# Altium project Somiqboard.PrjPcb
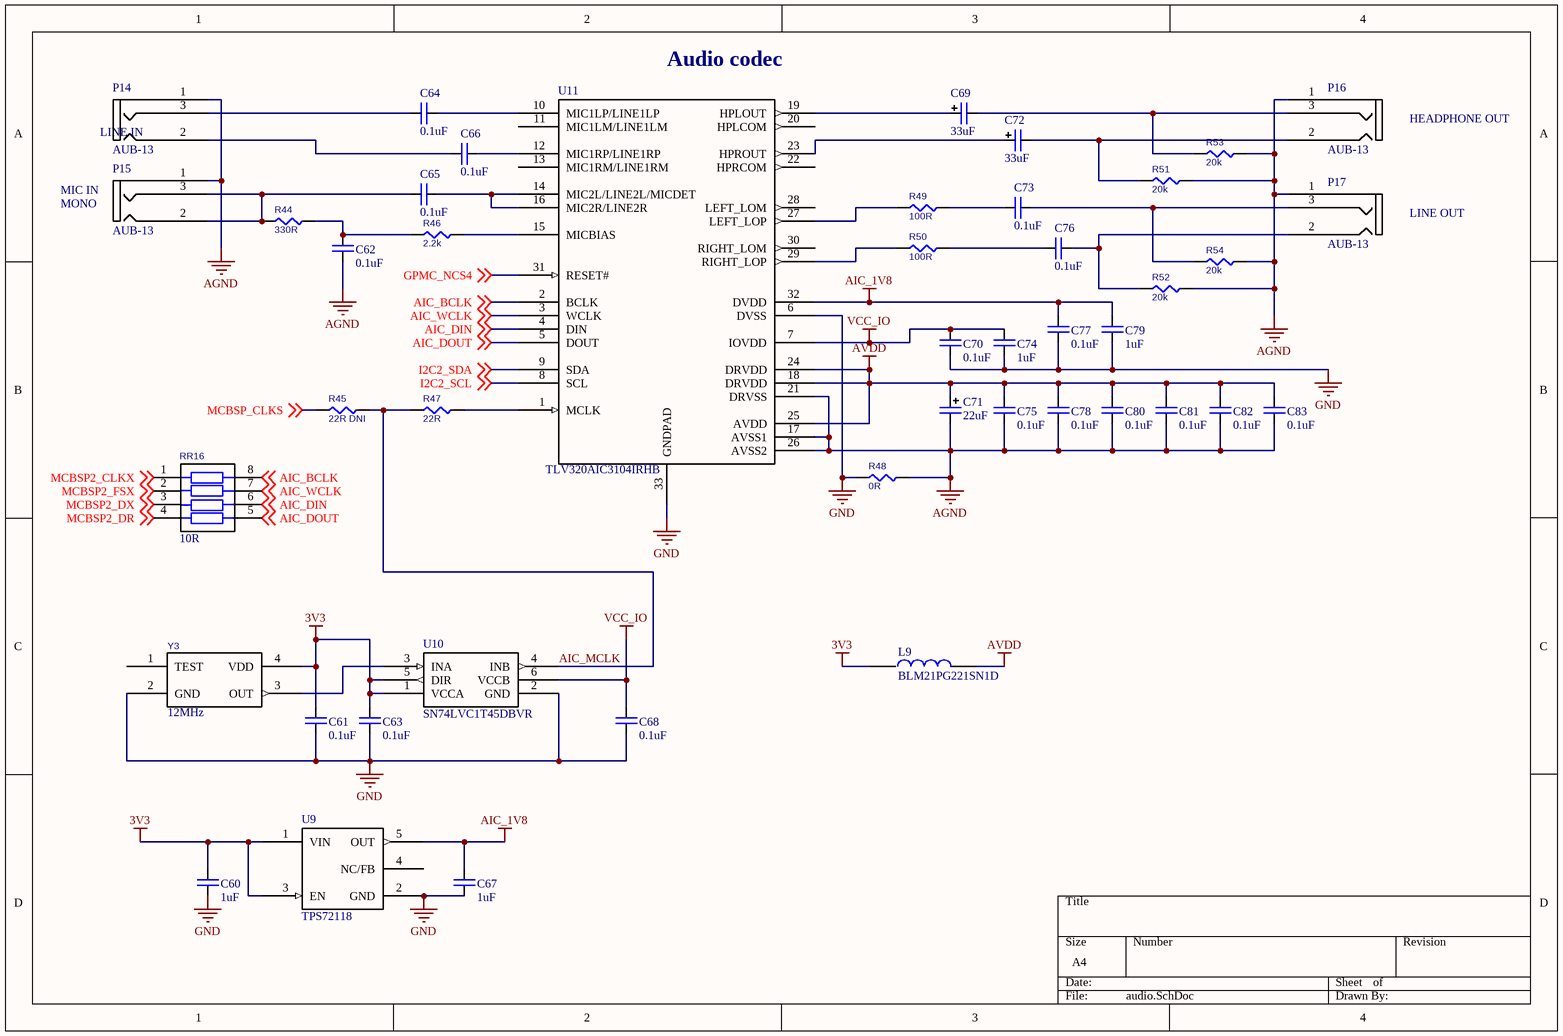
[diagram p0: audio.SchDoc]
9 sheets, 206 parts. Net scope: global (net labels, ports and power ports of the same name join across sheets).
Board file: somiqboard.PcbDoc
Sheets:
  audio.SchDoc
  camera.SchDoc
  ethernet.SchDoc
  hdmi.SchDoc
  power.SchDoc
  sd_mmc.SchDoc
  serial.SchDoc
  som_connectors.SchDoc
  usb.SchDoc

## Sheet audio.SchDoc
size A4

### Parts
(Parts that share a designator on the sheet are numbered #1, #2 ... from top to bottom, then left to right.)
C60  value 1uF  [CHIP0603]  (hidden comment: C0603)
C61  value 0.1uF  [CHIP0603]  (hidden comment: C0603)
C62  value 0.1uF  [CHIP0603]  (hidden comment: C0603)
C63  value 0.1uF  [CHIP0603]  (hidden comment: C0603)
C64  value 0.1uF  [CHIP0603]  (hidden comment: C0603)
C65  value 0.1uF  [CHIP0603]  (hidden comment: C0603)
C66  value 0.1uF  [CHIP0603]  (hidden comment: C0603)
C67  value 1uF  [CHIP0603]  (hidden comment: C0603)
C68  value 0.1uF  [CHIP0603]  (hidden comment: C0603)
C69  value 33uF  [B]  (hidden comment: CAP B)
C70  value 0.1uF  [CHIP0603]  (hidden comment: C0603)
C71  value 22uF  [B]  (hidden comment: CAP B)
C72  value 33uF  [B]  (hidden comment: CAP B)
C73#1  value 0.1uF  [CHIP0603]  (hidden comment: C0603)
C74#1  value 1uF  [CHIP0603]  (hidden comment: C0603)
C75  value 0.1uF  [CHIP0603]  (hidden comment: C0603)
C76  value 0.1uF  [CHIP0603]  (hidden comment: C0603)
C77  value 0.1uF  [CHIP0603]  (hidden comment: C0603)
C78  value 0.1uF  [CHIP0603]  (hidden comment: C0603)
C79  value 1uF  [CHIP0603]  (hidden comment: C0603)
C80  value 0.1uF  [CHIP0603]  (hidden comment: C0603)
C81  value 0.1uF  [CHIP0603]  (hidden comment: C0603)
C82  value 0.1uF  [CHIP0603]  (hidden comment: C0603)
C83  value 0.1uF  [CHIP0603]  (hidden comment: C0603)
L9  BLM21PG221SN1D  [Chip2PinSM127P600-8N]
P14  AUB-13  [AUB_13]
P15  AUB-13  [AUB_13]
P16  AUB-13  [AUB_13]
P17  AUB-13  [AUB_13]
R44  value 330R  [CHIP0603]  (hidden comment: R0603)
R45  value 22R DNI  [CHIP0603]  (hidden comment: R0603)
R46  value 2.2k  [CHIP0603]  (hidden comment: R0603)
R47  value 22R  [CHIP0603]  (hidden comment: R0603)
R48  value 0R  [CHIP0603]  (hidden comment: R0603)
R49  value 100R  [CHIP0603]  (hidden comment: R0603)
R50  value 100R  [CHIP0603]  (hidden comment: R0603)
R51  value 20k  [CHIP0603]  (hidden comment: R0603)
R52  value 20k  [CHIP0603]  (hidden comment: R0603)
R53  value 20k  [CHIP0603]  (hidden comment: R0603)
R54  value 20k  [CHIP0603]  (hidden comment: R0603)
RR16  value 10R  [PACKAGE-J4]  (hidden comment: CAY-J4)
U9  TPS72118  [SOT23-5]
U10  SN74LVC1T45DBVR  [SOT95P280X145-6L]
U11  Man P/N: TLV320AIC3104IRHB  [QFN32]  (hidden comment: TLV320AIC3104)
Y3  value 12MHz  [KXO_V97]  (hidden comment: KXO-V97)

### Nets
3V3: C60.1 C61.1 C63.1 L9.1 U9.1(VIN) U9.3(EN) U10.1(VCCA) U10.5(DIR) Y3.4(VDD)
AGND: C62.1 C71.2 C75.2 C78.2 C80.2 C81.2 C82.2 C83.2 P14.1(GND) P15.1(GND) P16.1(GND) P17.1(GND) R48.2 R51.1 R52.1 R53.1 R54.1 U11.17(AVSS1) U11.21(DRVSS) U11.26(AVSS2)
AIC_1V8: C67.1 C77.1 C79.1 U9.5(OUT) U11.32(DVDD)
AVDD: C71.1 C75.1 C78.1 C80.1 C81.1 C82.1 C83.1 L9.2 U11.18(DRVDD) U11.24(DRVDD) U11.25(AVDD)
GND: C60.2 C61.2 C63.2 C67.2 C68.2 C70.2 C74#1.2 C77.2 C79.2 R48.1 U9.2(GND) U10.2(GND) U11.6(DVSS) U11.33(GNDPAD) Y3.2(GND)
VCC_IO: C68.1 C70.1 C74#1.1 U10.6(VCCB) U11.7(IOVDD)
AIC_BCLK: RR16.8 U11.2(BCLK) ; off-sheet AIC_BCLK
AIC_DIN: RR16.6 U11.4(DIN) ; off-sheet AIC_DIN
AIC_DOUT: RR16.5 U11.5(DOUT) ; off-sheet AIC_DOUT
AIC_MCLK: R45.2 R47.1 U10.4(INB)
AIC_WCLK: RR16.7 U11.3(WCLK) ; off-sheet AIC_WCLK
GPMC_NCS4: U11.31(RESET#) ; off-sheet GPMC_NCS4
I2C2_SCL: U11.8(SCL) ; off-sheet I2C2_SCL
I2C2_SDA: U11.9(SDA) ; off-sheet I2C2_SDA
MCBSP2_CLKX: RR16.1 ; off-sheet MCBSP2_CLKX
MCBSP2_DR: RR16.4 ; off-sheet MCBSP2_DR
MCBSP2_DX: RR16.3 ; off-sheet MCBSP2_DX
MCBSP2_FSX: RR16.2 ; off-sheet MCBSP2_FSX
MCBSP_CLKS: R45.1 ; off-sheet MCBSP_CLKS
NetC62_2: C62.2 R44.2 R46.1
NetC64_1: C64.1 P14.3(LEFT)
NetC64_2: C64.2 U11.10(MIC1LP/LINE1LP)
NetC65_1: C65.1 P15.2(RIGHT) P15.3(LEFT) R44.1
NetC65_2: C65.2 U11.14(MIC2L/LINE2L/MICDET) U11.16(MIC2R/LINE2R)
NetC66_1: C66.1 P14.2(RIGHT)
NetC66_2: C66.2 U11.12(MIC1RP/LINE1RP)
NetC69_1: C69.1 U11.19(HPLOUT)
NetC69_2: C69.2 P16.3(LEFT) R53.2
NetC72_1: C72.1 U11.23(HPROUT)
NetC72_2: C72.2 P16.2(RIGHT) R51.2
NetC73#1_1: C73#1.1 R49.2
NetC73#1_2: C73#1.2 P17.3(LEFT) R54.2
NetC76_1: C76.1 R50.2
NetC76_2: C76.2 P17.2(RIGHT) R52.2
NetR46_2: R46.2 U11.15(MICBIAS)
NetR47_2: R47.2 U11.1(MCLK)
NetR49_1: R49.1 U11.27(LEFT_LOP)
NetR50_1: R50.1 U11.29(RIGHT_LOP)
NetU10_3: U10.3(INA) Y3.3(OUT)

Not connected (* = marked no-connect by the designer): U9 4(NC/FB); U11 11(MIC1LM/LINE1LM) 13(MIC1RM/LINE1RM) 20(HPLCOM) 22(HPRCOM) 28(LEFT_LOM) 30(RIGHT_LOM); Y3 1(TEST)

### Notes on the sheet
- (near U11) Audio codec
- LINE IN
- HEADPHONE OUT
- MIC IN
  MONO
- LINE OUT

### Library data of the parts
C60-C68 C70 C73#1 C74#1 C75-C83 = C0603: Ceramic capacitor C0603
C69 C71 C72 = CAP B: Tantalum capacitor. Case B
L9 = BLM21PG221SN1D: Manufacturer: Murata; Man P/N: BLM21PG221SN1D
P14-P17 = AUB-13: Audio connector mini-jack 3.5mm, 3 pins; Vendor: brownbear.ru
R44-R54 = R0603: Resistor 0603
RR16 = CAY-J4: Resistor network 4x
U9 = TPS72118: LOW INPUT VOLTAGE, CAP FREE 150-mA; Manufacturer: TI; Man P/N: TPS72118DBV; Man 2 P/N: NCP699SN18
U10 = SN74LVC1T45: Single-Bit Dual-Supply Bus Transceiver; Manufacturer: Texas Instruments; URL: http://focus.ti.com/docs/prod/folders/print/sn74lvc1t45.html; Man P/N: SN74LVC1T45DBVR
U11 = TLV320AIC3104: LOW-POWER STEREO AUDIO CODEC FOR PORTABLE AUDIO/TELEPHONY; Manufacturer: TI
Y3 = KXO-V97: Quartz oscillator 7x5mm; Manufacturer: Geyer; Man P/N: KXO-V97

## Sheet camera.SchDoc
size A4
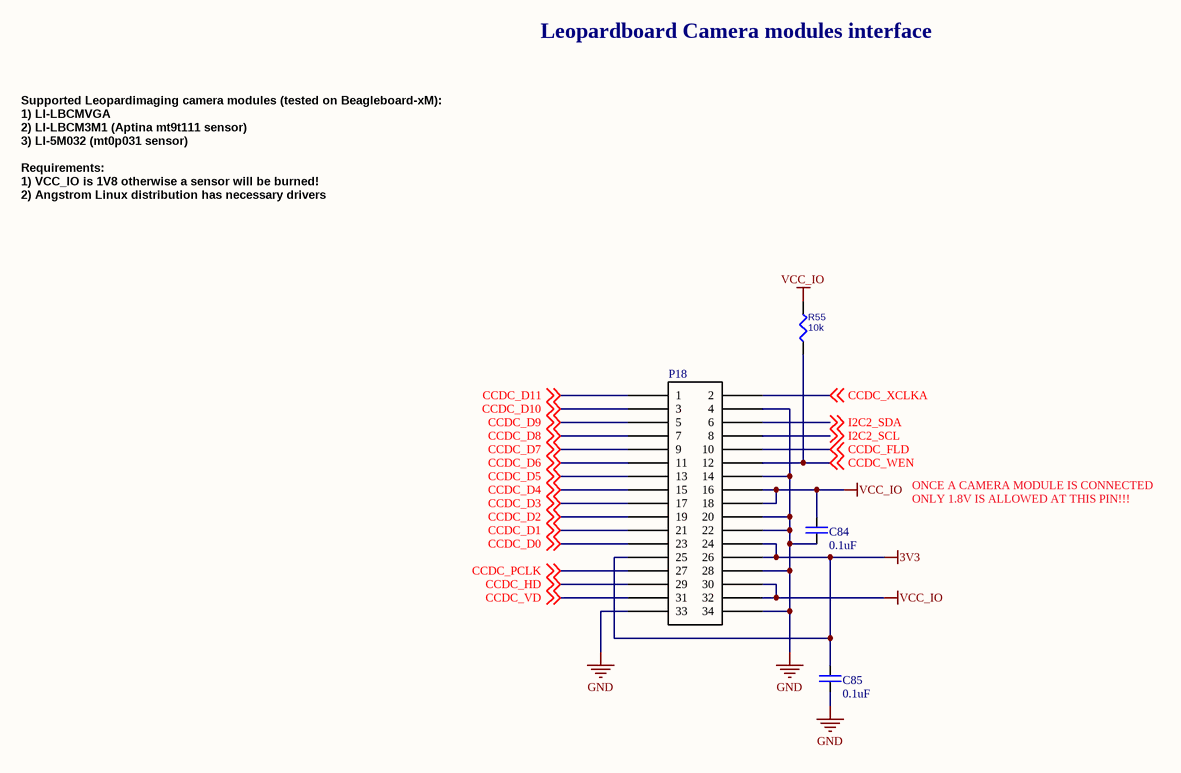
[diagram p1: camera.SchDoc]

### Parts
C84  value 0.1uF  [CHIP0603]  (hidden comment: C0603)
C85  value 0.1uF  [CHIP0603]  (hidden comment: C0603)
P18  20021321-00034T4LF  [20021321-00034T4LF]  (value not drawn)
R55  value 10k  [CHIP0603]  (hidden comment: R0603)

### Nets
3V3: C85.1 P18.24 P18.25 P18.26
GND: C84.2 C85.2 P18.4 P18.14 P18.20 P18.22 P18.28 P18.33 P18.34
VCC_IO: C84.1 P18.16 P18.18 P18.30 P18.32 R55.2
CCDC_D0: P18.23 ; off-sheet CCDC_D0
CCDC_D1: P18.21 ; off-sheet CCDC_D1
CCDC_D2: P18.19 ; off-sheet CCDC_D2
CCDC_D3: P18.17 ; off-sheet CCDC_D3
CCDC_D4: P18.15 ; off-sheet CCDC_D4
CCDC_D5: P18.13 ; off-sheet CCDC_D5
CCDC_D6: P18.11 ; off-sheet CCDC_D6
CCDC_D7: P18.9 ; off-sheet CCDC_D7
CCDC_D8: P18.7 ; off-sheet CCDC_D8
CCDC_D9: P18.5 ; off-sheet CCDC_D9
CCDC_D10: P18.3 ; off-sheet CCDC_D10
CCDC_D11: P18.1 ; off-sheet CCDC_D11
CCDC_FLD: P18.10 ; off-sheet CCDC_FLD
CCDC_HD: P18.29 ; off-sheet CCDC_HD
CCDC_PCLK: P18.27 ; off-sheet CCDC_PCLK
CCDC_VD: P18.31 ; off-sheet CCDC_VD
CCDC_WEN: P18.12 R55.1 ; off-sheet CCDC_WEN
CCDC_XCLKA: P18.2 ; off-sheet CCDC_XCLKA
I2C2_SCL: P18.8 ; off-sheet I2C2_SCL
I2C2_SDA: P18.6 ; off-sheet I2C2_SDA

### Notes on the sheet
- Leopardboard Camera modules interface
- Supported Leopardimaging camera modules (tested on Beagleboard-xM):
  1) LI-LBCMVGA
  2) LI-LBCM3M1 (Aptina mt9t111 sensor)
  3) LI-5M032 (mt0p031 sensor)
  Requirements:
  1) VCC_IO is 1V8 otherwise a sensor will be burned!
  2) Angstrom Linux distribution has necessary drivers
- ONCE A CAMERA MODULE IS CONNECTED
  ONLY 1.8V IS ALLOWED AT THIS PIN!!!

### Library data of the parts
C84 C85 = C0603: Ceramic capacitor C0603
P18 = 20021321-00034T4LF: CONN RECEPT 34POS DUAL SMD; Manufacturer: Minitek; Vendor: Digikey; Vendor P/N: 609-3777-ND; Man P/N: 20021321-00034T4LF
R55 = R0603: Resistor 0603

## Sheet ethernet.SchDoc
size A4
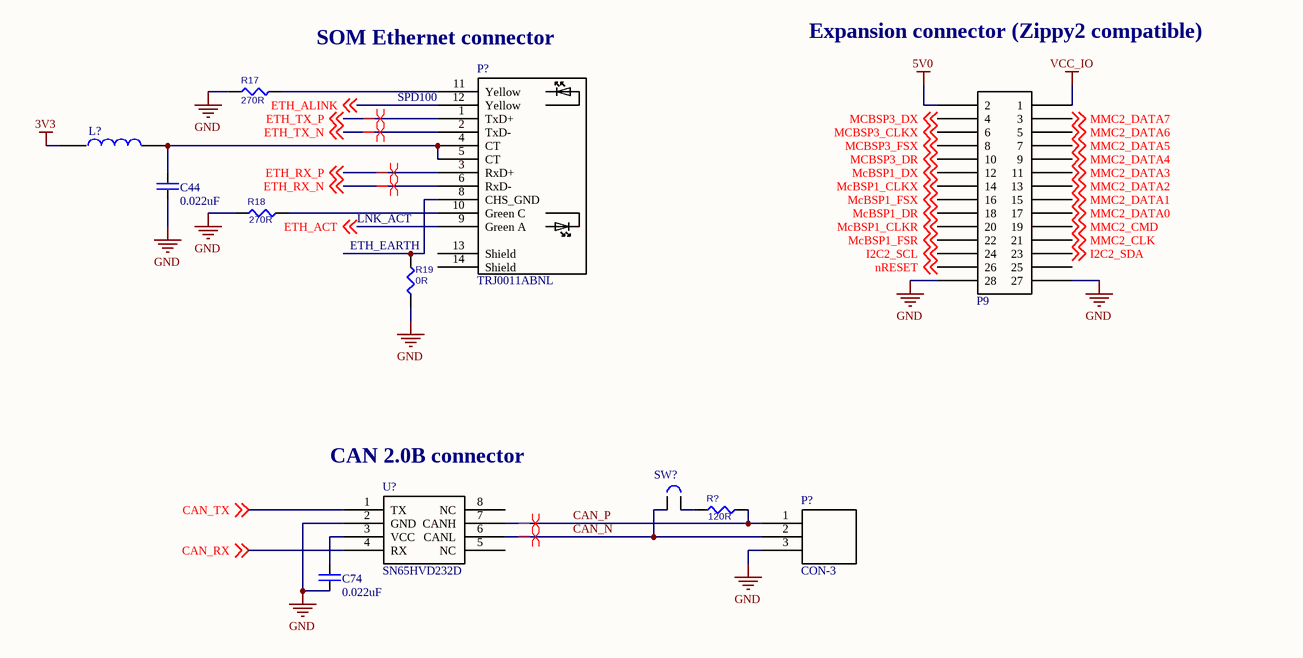
[diagram p2: ethernet.SchDoc]

### Parts
(Parts that share a designator on the sheet are numbered #1, #2 ... from top to bottom, then left to right.)
C44  value 0.022uF  [CHIP0603]  (hidden comment: C0603)
C74#2  value 0.022uF  [CHIP0603]  (hidden comment: C0603)
L?  BLM18A-FB  [CHIP0603]  (value not drawn)
P9  PBD-28  [HDR2X14_Board2]  (value not drawn)
P?#1  TRJ0011ABNL
P?#2  CON-3
R17  value 270R  [CHIP0603]  (hidden comment: R0603)
R18  value 270R  [CHIP0603]  (hidden comment: R0603)
R19  value 0R  [CHIP0603]  (hidden comment: R0603)
R?#1  value 120R  [CHIP0603]  (hidden comment: R0603)
SW?#1  Jumper 2-pin  [JUMPER_2]  (value not drawn)
U?#1  SN65HVD232D

### Nets
3V3: L?.1
5V0: P9.2
GND: C44.2 C74#2.2 P9.27 P9.28 P?#2.3 R17.1 R18.1 R19.1 U?#1.2(GND)
VCC_IO: P9.1
CAN_N: P?#2.2 SW?#1.1 U?#1.6(CANL)
CAN_P: P?#2.1 R?#1.2 U?#1.7(CANH)
CAN_RX: U?#1.4(RX) ; off-sheet CAN_RX
CAN_TX: U?#1.1(TX) ; off-sheet CAN_TX
ETH_ACT: P?#1.9(Green_A) ; off-sheet ETH_ACT
ETH_ALINK: P?#1.12(Yellow) ; off-sheet ETH_ALINK
ETH_RX_N: P?#1.6(RxD-) ; off-sheet ETH_RX_N
ETH_RX_P: P?#1.3(RxD+) ; off-sheet ETH_RX_P
ETH_TX_N: P?#1.2(TxD-) ; off-sheet ETH_TX_N
ETH_TX_P: P?#1.1(TxD+) ; off-sheet ETH_TX_P
I2C2_SCL: P9.24 ; off-sheet I2C2_SCL
I2C2_SDA: P9.23 ; off-sheet I2C2_SDA
McBSP1_CLKR: P9.20 ; off-sheet McBSP1_CLKR
McBSP1_CLKX: P9.14 ; off-sheet McBSP1_CLKX
McBSP1_DR: P9.18 ; off-sheet McBSP1_DR
McBSP1_DX: P9.12 ; off-sheet McBSP1_DX
McBSP1_FSR: P9.22 ; off-sheet McBSP1_FSR
McBSP1_FSX: P9.16 ; off-sheet McBSP1_FSX
MCBSP3_CLKX: P9.6 ; off-sheet MCBSP3_CLKX
MCBSP3_DR: P9.10 ; off-sheet MCBSP3_DR
MCBSP3_DX: P9.4 ; off-sheet MCBSP3_DX
MCBSP3_FSX: P9.8 ; off-sheet MCBSP3_FSX
MMC2_CLK: P9.21 ; off-sheet MMC2_CLK
MMC2_CMD: P9.19 ; off-sheet MMC2_CMD
MMC2_DATA0: P9.17 ; off-sheet MMC2_DATA0
MMC2_DATA1: P9.15 ; off-sheet MMC2_DATA1
MMC2_DATA2: P9.13 ; off-sheet MMC2_DATA2
MMC2_DATA3: P9.11 ; off-sheet MMC2_DATA3
MMC2_DATA4: P9.9 ; off-sheet MMC2_DATA4
MMC2_DATA5: P9.7 ; off-sheet MMC2_DATA5
MMC2_DATA6: P9.5 ; off-sheet MMC2_DATA6
MMC2_DATA7: P9.3 ; off-sheet MMC2_DATA7
nRESET: P9.26 ; off-sheet nRESET
NetC44_1: C44.1 L?.2 P?#1.4(CT) P?#1.5(CT)
NetC74#2_1: C74#2.1 U?#1.3(VCC)
NetP?#1_8: P?#1.8(CHS_GND) R19.2
NetP?#1_10: P?#1.10(Green_C) R18.2
NetP?#1_11: P?#1.11(Yellow) R17.2
NetR?#1_1: R?#1.1 SW?#1.2

Not connected (* = marked no-connect by the designer): P9 25; P?#1 13(Shield) 14(Shield); U?#1 5(NC) 8(NC)

### Layout directives
differential pair: CAN_N, CAN_P, ETH_RX_N, ETH_RX_P, ETH_TX_N, ETH_TX_P

### Notes on the sheet
- SOM Ethernet connector
- Expansion connector (Zippy2 compatible)
- (near P?#1) SPD100
- (near R19) LNK_ACT
- (near R19) ETH_EARTH
- (near U?#1) CAN 2.0B connector

### Library data of the parts
C44 C74#2 = C0603: Ceramic capacitor C0603
L? = BLM18A-FB: Chip EMIFILr Inductor Type; Manufacturer: Murata; Man P/N: BLM18PG121SN1D
P9 = PBD-28: 2.54x2.54mm double row connector, 28pins; Vendor: Major League; Man P/N: LSWSS-128-D-02-G
P?#1 = TRJ0011ABNL: Network filter/connector RJ45; Manufacturer: Trxcom; Vendor: Eltech.spb.ru; Man P/N: TRJ0011ABNL
P?#2 = CON-3: 2.54mm connector
R17-R19 R?#1 = R0603: Resistor 0603
SW?#1 = Jumper 2-pin: Jumper 2-pin 2.54mm
U?#1 = SN65HVD232D: 3.3-V CAN TRANSCEIVER; Manufacturer: Texas Instruments; Man P/N: SN65HVD232D

## Sheet hdmi.SchDoc
size 386 x 246 mm
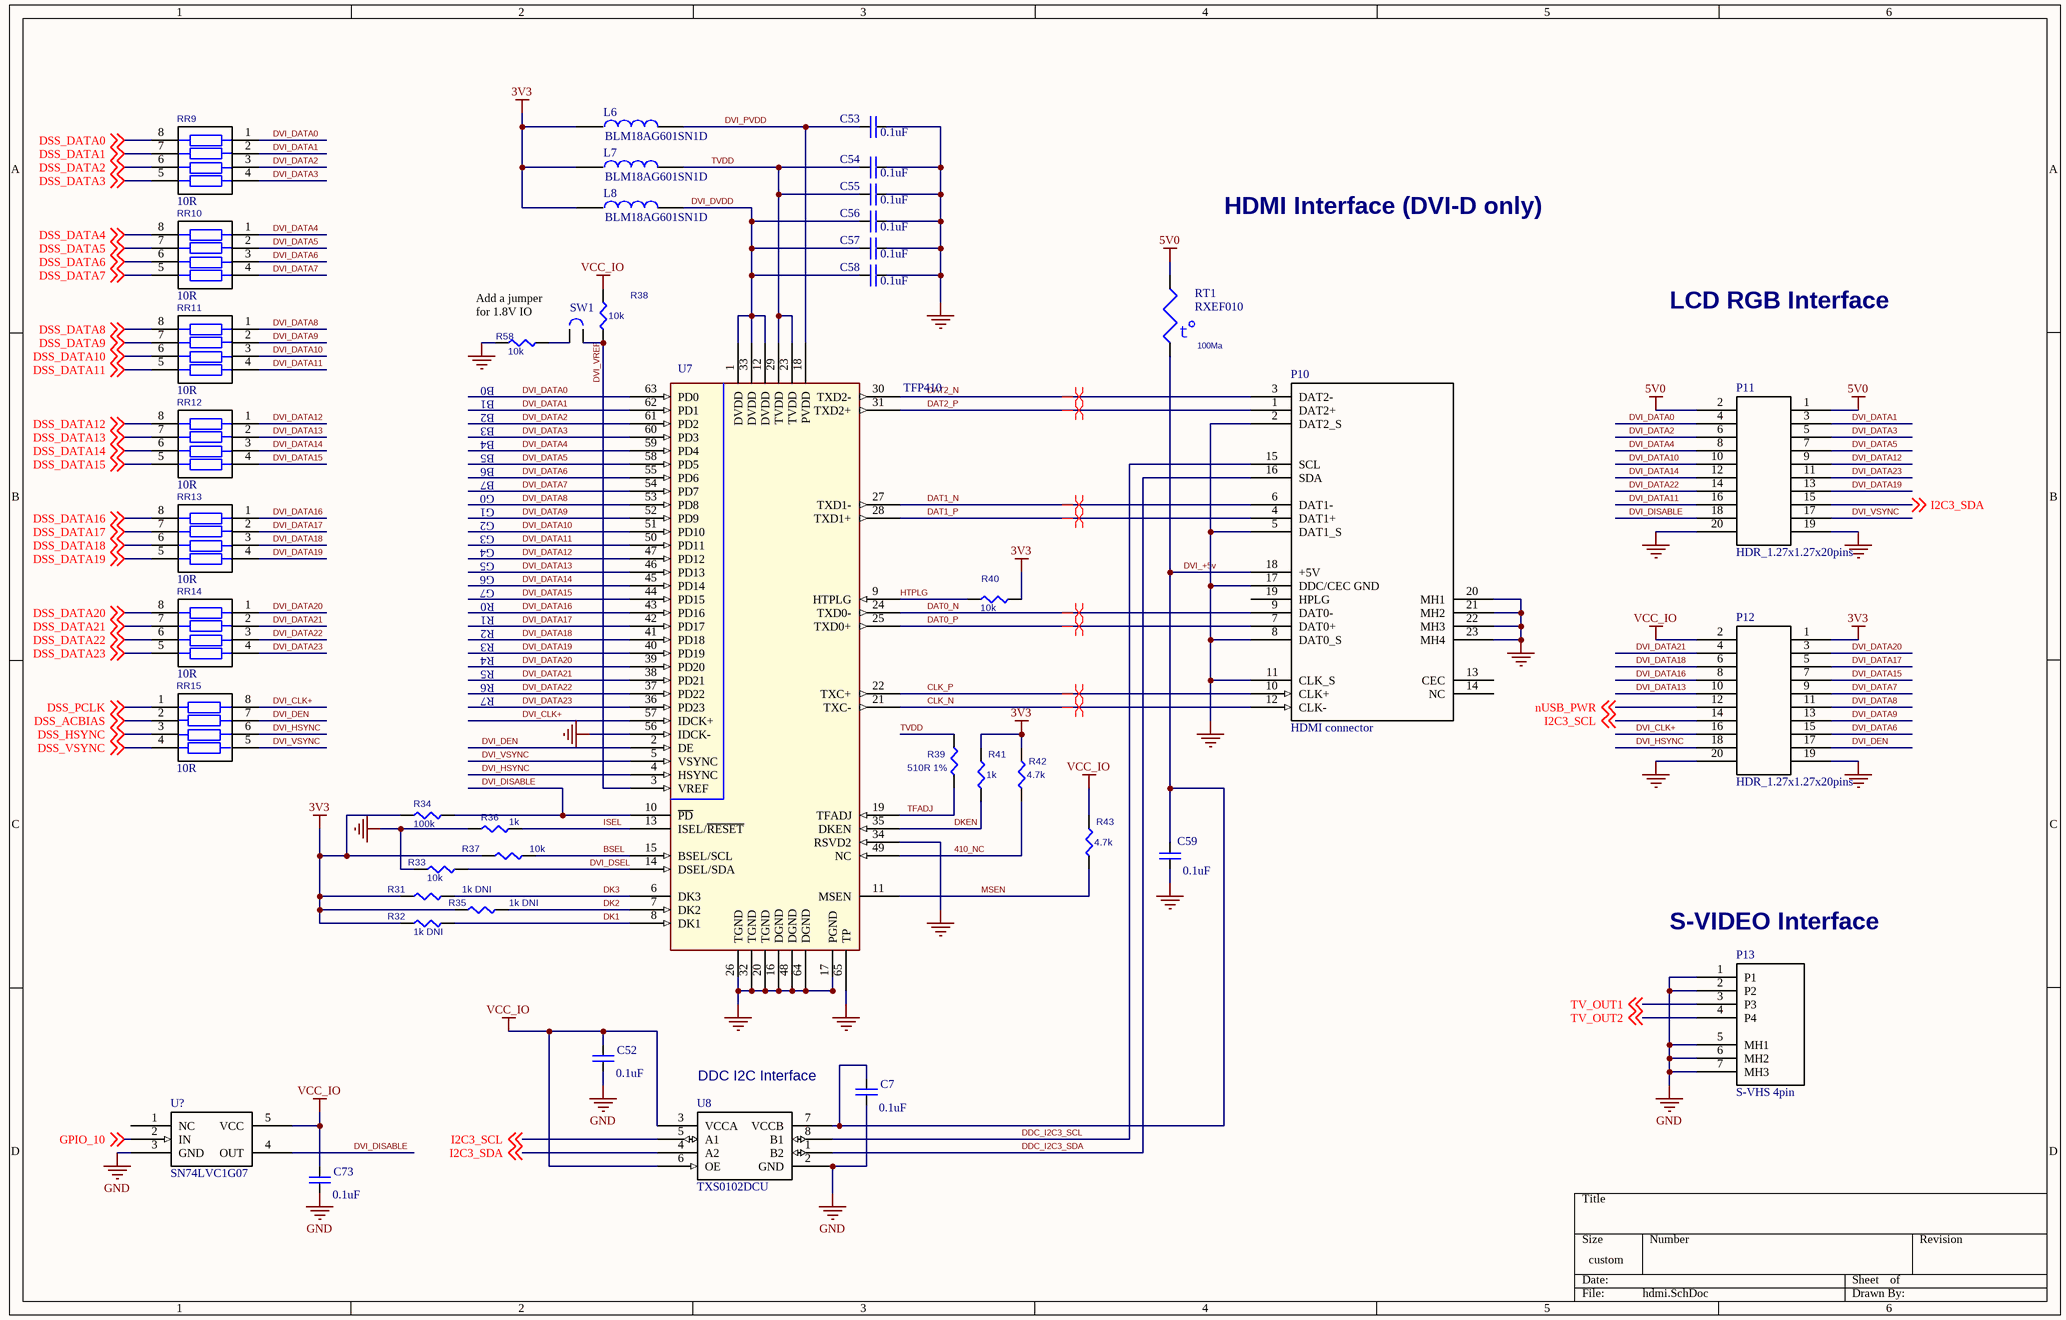
[diagram p3: hdmi.SchDoc]

### Parts
(Parts that share a designator on the sheet are numbered #1, #2 ... from top to bottom, then left to right.)
C7#1  value 0.1uF  [CHIP0603]  (hidden comment: C0603)
C52  value 0.1uF  [CHIP0603]  (hidden comment: C0603)
C53  value 0.1uF  [CHIP0603]  (hidden comment: C0603)
C54  value 0.1uF  [CHIP0603]  (hidden comment: C0603)
C55  value 0.1uF  [CHIP0603]  (hidden comment: C0603)
C56  value 0.1uF  [CHIP0603]  (hidden comment: C0603)
C57  value 0.1uF  [CHIP0603]  (hidden comment: C0603)
C58  value 0.1uF  [CHIP0603]  (hidden comment: C0603)
C59  value 0.1uF  [CHIP0603]  (hidden comment: C0603)
C73#2  value 0.1uF  [CHIP0603]  (hidden comment: C0603)
L6#1  Man P/N: BLM18AG601SN1D  [CHIP0603]  (hidden comment: BLM18A-FB)
L7  Man P/N: BLM18AG601SN1D  [CHIP0603]  (hidden comment: BLM18A-FB)
L8  Man P/N: BLM18AG601SN1D  [CHIP0603]  (hidden comment: BLM18A-FB)
P10  HDMI connector  [HDMI connector]
P11  HDR_1.27x1.27x20pins  [MHDR2X10]
P12  HDR_1.27x1.27x20pins  [MHDR2X10]
P13  S-VHS 4pin  [MDN-4FR]
R31  value 1k DNI  [CHIP0603]  (hidden comment: R0603)
R32  value 1k DNI  [CHIP0603]  (hidden comment: R0603)
R33  value 10k  [CHIP0603]  (hidden comment: R0603)
R34  value 100k  [CHIP0603]  (hidden comment: R0603)
R35  value 1k DNI  [CHIP0603]  (hidden comment: R0603)
R36  value 1k  [CHIP0603]  (hidden comment: R0603)
R37  value 10k  [CHIP0603]  (hidden comment: R0603)
R38  value 10k  [CHIP0603]  (hidden comment: R0603)
R39  value 510R 1%  [CHIP0603]  (hidden comment: R0603)
R40  value 10k  [CHIP0603]  (hidden comment: R0603)
R41  value 1k  [CHIP0603]  (hidden comment: R0603)
R42  value 4.7k  [CHIP0603]  (hidden comment: R0603)
R43  value 4.7k  [CHIP0603]  (hidden comment: R0603)
R58  value 10k  [CHIP0603]  (hidden comment: R0603)
RR9  value 10R  [PACKAGE-J4]  (hidden comment: CAY-J4)
RR10  value 10R  [PACKAGE-J4]  (hidden comment: CAY-J4)
RR11  value 10R  [PACKAGE-J4]  (hidden comment: CAY-J4)
RR12  value 10R  [PACKAGE-J4]  (hidden comment: CAY-J4)
RR13  value 10R  [PACKAGE-J4]  (hidden comment: CAY-J4)
RR14  value 10R  [PACKAGE-J4]  (hidden comment: CAY-J4)
RR15  value 10R  [PACKAGE-J4]  (hidden comment: CAY-J4)
RT1  Man P/N: RXEF010  [PTC]  (hidden comment: PTC)
SW1  Jumper 2-pin  [JUMPER_2]  (value not drawn)
U7  TFP410  [PQFP64]
U8  TXS0102DCU  [PDSO8_DCU]
U?#2  SN74LVC1G07

### Nets
3V3: L6#1.1 L7.1 L8.1 P12.1 R31.1 R32.1 R34.1 R35.1 R37.1 R40.2 R41.1 R42.1
5V0: P11.1 P11.2 RT1.1
GND: C7#1.1 C52.1 C53.2 C54.2 C55.2 C56.2 C57.2 C58.2 C59.2 C73#2.1 P10.2(DAT2_S) P10.5(DAT1_S) P10.8(DAT0_S) P10.11(CLK_S) P10.17(DDC/CEC_GND) P10.20(MH1) P10.21(MH2) P10.22(MH3) P10.23(MH4) P11.19 P11.20 P12.19 P12.20 P13.1(P1) P13.2(P2) P13.5(MH1) P13.6(MH2) P13.7(MH3) R33.1 R36.1 R58.1 U7.16(DGND) U7.17(PGND) U7.20(TGND) U7.26(TGND) U7.32(TGND) U7.34(RSVD2) U7.48(DGND) U7.56(IDCK-) U7.64(DGND) U7.65(TP) U8.2(GND) U?#2.3(GND)
VCC_IO: C52.2 C73#2.2 P12.2 R38.1 R43.1 U8.3(VCCA) U8.6(OE) U?#2.5(VCC)
410_NC: R42.2 U7.49(NC)
BSEL: R37.2 U7.15(BSEL/SCL)
CLK_N: P10.12(CLK-) U7.21(TXC-)
CLK_P: P10.10(CLK+) U7.22(TXC+)
DAT0_N: P10.9(DAT0-) U7.24(TXD0-)
DAT0_P: P10.7(DAT0+) U7.25(TXD0+)
DAT1_N: P10.6(DAT1-) U7.27(TXD1-)
DAT1_P: P10.4(DAT1+) U7.28(TXD1+)
DAT2_N: P10.3(DAT2-) U7.30(TXD2-)
DAT2_P: P10.1(DAT2+) U7.31(TXD2+)
DDC_I2C3_SCL: P10.15(SCL) U8.8(B1)
DDC_I2C3_SDA: P10.16(SDA) U8.1(B2)
DK1: R32.2 U7.8(DK1)
DK2: R35.2 U7.7(DK2)
DK3: R31.2 U7.6(DK3)
DKEN: R41.2 U7.35(DKEN)
DSS_ACBIAS: RR15.2 ; off-sheet DSS_ACBIAS
DSS_DATA0: RR9.8 ; off-sheet DSS_DATA0
DSS_DATA1: RR9.7 ; off-sheet DSS_DATA1
DSS_DATA2: RR9.6 ; off-sheet DSS_DATA2
DSS_DATA3: RR9.5 ; off-sheet DSS_DATA3
DSS_DATA4: RR10.8 ; off-sheet DSS_DATA4
DSS_DATA5: RR10.7 ; off-sheet DSS_DATA5
DSS_DATA6: RR10.6 ; off-sheet DSS_DATA6
DSS_DATA7: RR10.5 ; off-sheet DSS_DATA7
DSS_DATA8: RR11.8 ; off-sheet DSS_DATA8
DSS_DATA9: RR11.7 ; off-sheet DSS_DATA9
DSS_DATA10: RR11.6 ; off-sheet DSS_DATA10
DSS_DATA11: RR11.5 ; off-sheet DSS_DATA11
DSS_DATA12: RR12.8 ; off-sheet DSS_DATA12
DSS_DATA13: RR12.7 ; off-sheet DSS_DATA13
DSS_DATA14: RR12.6 ; off-sheet DSS_DATA14
DSS_DATA15: RR12.5 ; off-sheet DSS_DATA15
DSS_DATA16: RR13.8 ; off-sheet DSS_DATA16
DSS_DATA17: RR13.7 ; off-sheet DSS_DATA17
DSS_DATA18: RR13.6 ; off-sheet DSS_DATA18
DSS_DATA19: RR13.5 ; off-sheet DSS_DATA19
DSS_DATA20: RR14.8 ; off-sheet DSS_DATA20
DSS_DATA21: RR14.7 ; off-sheet DSS_DATA21
DSS_DATA22: RR14.6 ; off-sheet DSS_DATA22
DSS_DATA23: RR14.5 ; off-sheet DSS_DATA23
DSS_HSYNC: RR15.3 ; off-sheet DSS_HSYNC
DSS_PCLK: RR15.1 ; off-sheet DSS_PCLK
DSS_VSYNC: RR15.4 ; off-sheet DSS_VSYNC
DVI_+5v: C7#1.2 C59.1 P10.18(+5V) RT1.2 U8.7(VCCB)
DVI_CLK+: P12.16 RR15.8 U7.57(IDCK+)
DVI_DATA0: P11.4 RR9.1 U7.63(PD0)
DVI_DATA1: P11.3 RR9.2 U7.62(PD1)
DVI_DATA2: P11.6 RR9.3 U7.61(PD2)
DVI_DATA3: P11.5 RR9.4 U7.60(PD3)
DVI_DATA4: P11.8 RR10.1 U7.59(PD4)
DVI_DATA5: P11.7 RR10.2 U7.58(PD5)
DVI_DATA6: P12.15 RR10.3 U7.55(PD6)
DVI_DATA7: P12.9 RR10.4 U7.54(PD7)
DVI_DATA8: P12.11 RR11.1 U7.53(PD8)
DVI_DATA9: P12.13 RR11.2 U7.52(PD9)
DVI_DATA10: P11.10 RR11.3 U7.51(PD10)
DVI_DATA11: P11.16 RR11.4 U7.50(PD11)
DVI_DATA12: P11.9 RR12.1 U7.47(PD12)
DVI_DATA13: P12.10 RR12.2 U7.46(PD13)
DVI_DATA14: P11.12 RR12.3 U7.45(PD14)
DVI_DATA15: P12.7 RR12.4 U7.44(PD15)
DVI_DATA16: P12.8 RR13.1 U7.43(PD16)
DVI_DATA17: P12.5 RR13.2 U7.42(PD17)
DVI_DATA18: P12.6 RR13.3 U7.41(PD18)
DVI_DATA19: P11.13 RR13.4 U7.40(PD19)
DVI_DATA20: P12.3 RR14.1 U7.39(PD20)
DVI_DATA21: P12.4 RR14.2 U7.38(PD21)
DVI_DATA22: P11.14 RR14.3 U7.37(PD22)
DVI_DATA23: P11.11 RR14.4 U7.36(PD23)
DVI_DEN: P12.17 RR15.7 U7.2(DE)
DVI_DISABLE: P11.18 R34.2 U7.10(~{PD}) U?#2.4(OUT)
DVI_DSEL: R33.2 U7.14(DSEL/SDA)
DVI_DVDD: C56.1 C57.1 C58.1 L8.2 U7.1(DVDD) U7.12(DVDD) U7.33(DVDD)
DVI_HSYNC: P12.18 RR15.6 U7.4(HSYNC)
DVI_PVDD: C53.1 L6#1.2 U7.18(PVDD)
DVI_VREF: R38.2 SW1.2 U7.3(VREF)
DVI_VSYNC: P11.17 RR15.5 U7.5(VSYNC)
GPIO_10: U?#2.2(IN) ; off-sheet GPIO_10
HTPLG: R40.1 U7.9(HTPLG)
I2C3_SCL: P12.14 U8.5(A1) ; off-sheet I2C3_SCL
I2C3_SDA: P11.15 U8.4(A2) ; off-sheet I2C3_SDA
ISEL: R36.2 U7.13(ISEL/~{RESET})
MSEN: R43.2 U7.11(MSEN)
nUSB_PWR: P12.12 ; off-sheet nUSB_PWR
TFADJ: R39.2 U7.19(TFADJ)
TV_OUT1: P13.3(P3) ; off-sheet TV_OUT1
TV_OUT2: P13.4(P4) ; off-sheet TV_OUT2
TVDD: C54.1 C55.1 L7.2 R39.1 U7.23(TVDD) U7.29(TVDD)
NetR58_2: R58.2 SW1.1

Not connected (* = marked no-connect by the designer): P10 13(CEC) 14(NC) 19(HPLG); U?#2 1(NC)

### Layout directives
differential pair: CLK_N, CLK_P, DAT0_N, DAT0_P, DAT1_N, DAT1_P, DAT2_N, DAT2_P

### Notes on the sheet
- HDMI Interface (DVI-D only)
- (near SW1) Add a jumper
  for 1.8V IO
- LCD RGB Interface
- B1
- (near R58) B0
- (near RT1) 100Ma
- B5
- B4
- B3
- B2
- B6
- B7
- G0
- G1
- G2
- G3
- G5
- G4
- G6
- G7
- R0
- R1
- R2
- R3
- R4
- R5
- R6
- R7
- (near P13) S-VIDEO Interface
- DDC I2C Interface
- (in symbol PTC) t

### Library data of the parts
C7#1 C52-C59 C73#2 = C0603: Ceramic capacitor C0603
L6#1 L7 L8 = BLM18A-FB: Chip EMIFILr Inductor Type; Manufacturer: Murata
P10 = HDMI connector: 1.0 HDMI RIGHT ANGLE 19-pin; Man P/N A: Molex 47151-0001; Man P/N: PulseEng E810K-SB0G1X-L
P11 P12 = HDR_1.27x1.27x20pins: Dual Raw Socket Strip; Manufacturer: Major League; Man P/N: TSHC-510-D-06-340-G-LF
P13 = S-VHS 4pin: S-Video PCB-Connector 4 pin; URL: http://www.brownbear.ru/goods/2398.html; Man P/N: MDN-4FR
R31-R43 R58 = R0603: Resistor 0603
RR9-RR15 = CAY-J4: Resistor network 4x
RT1 = PTC: POLYSWITCH PTC RESET 0.1A; Manufacturer: TE Connectivity
SW1 = Jumper 2-pin: Jumper 2-pin 2.54mm
U7 = tfp513_1: TI PanelBus digital transmitter; Man P/N: TFP410PAP; Manufacturer: TI
U8 = TXS0102DCU: 2bit Bidirectional voltage translator; Manufacturer: TI; Package: DCU; Man P/N: TXS0102DCU
U?#2 = SN74LVC1G07: SINGLE BUFFER/DRIVER WITH OPEN-DRAIN OUTPUT; Man P/N: SN74LVC1G07DCKT; Package: DCK

## Sheet power.SchDoc
size A4
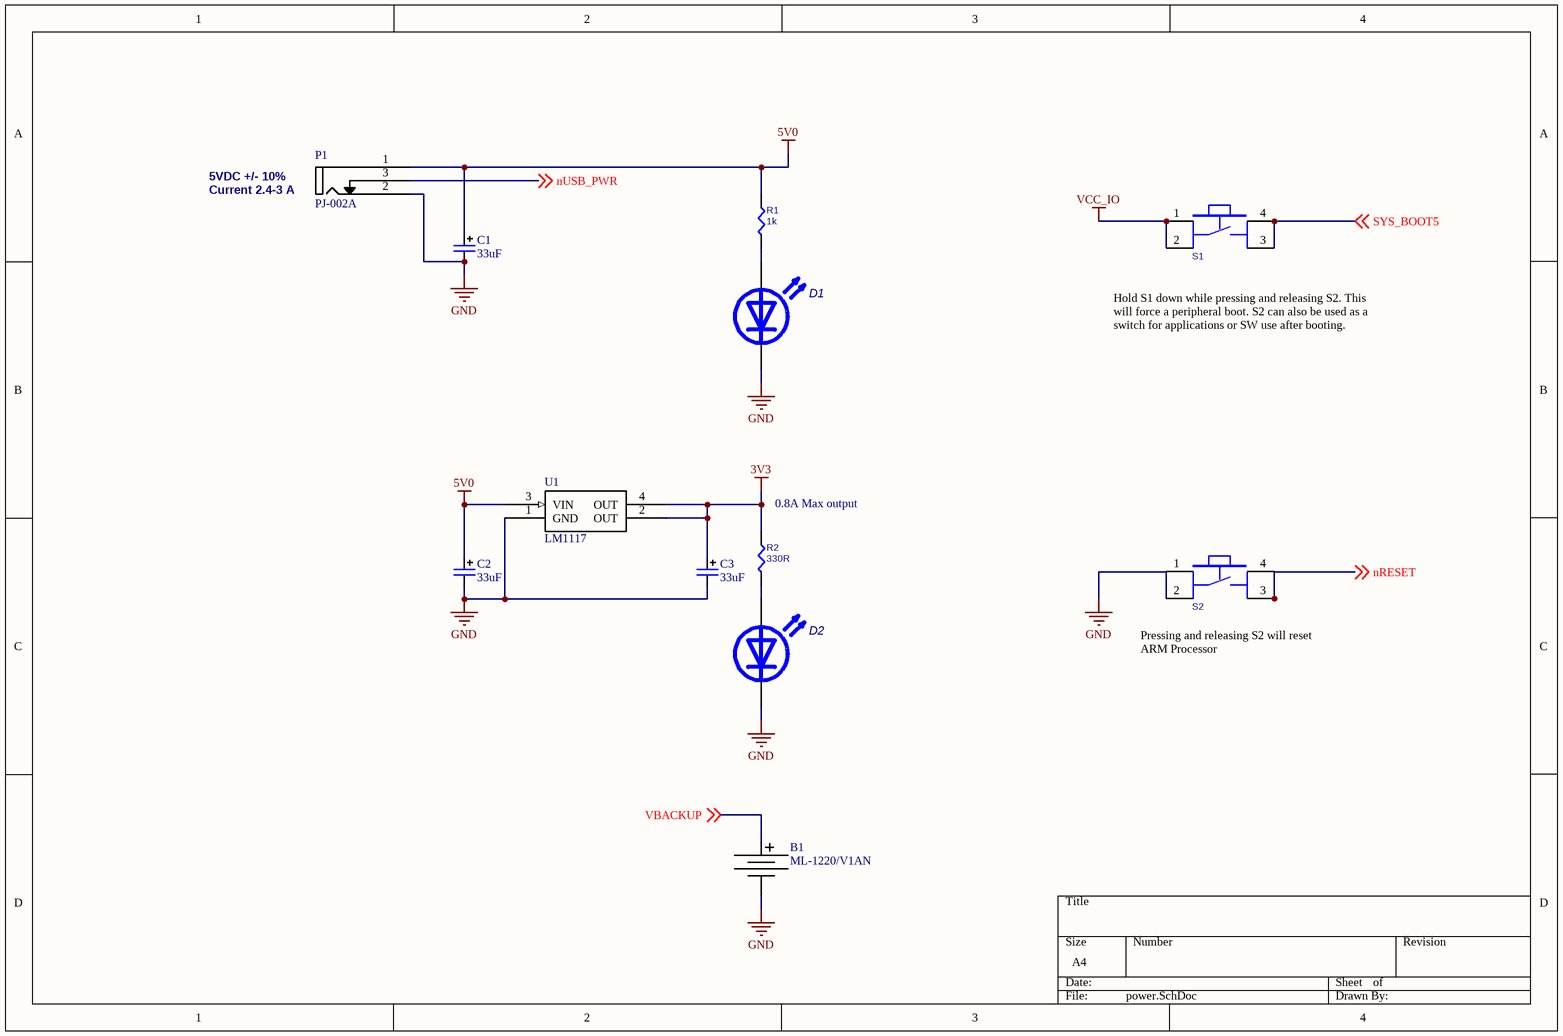
[diagram p4: power.SchDoc]

### Parts
B1  ML-1220/V1AN  [ML1220-V1AN]
C1  value 33uF  [B]  (hidden comment: CAP B)
C2  value 33uF  [B]  (hidden comment: CAP B)
C3  value 33uF  [B]  (hidden comment: CAP B)
D1  LED0805  [LED0805]  (value not drawn)
D2  LED0805  [LED0805]  (value not drawn)
P1  PJ-002A  [PJ-002A]
R1  value 1k  [CHIP0603]  (hidden comment: R0603)
R2  value 330R  [CHIP0603]  (hidden comment: R0603)
S1  SWT-32  [SWT-32]  (value not drawn)
S2  SWT-32  [SWT-32]  (value not drawn)
U1  LM1117  [SOT223]

### Nets
3V3: C3.1 R2.2 U1.2(OUT) U1.4(OUT)
5V0: C1.1 C2.1 P1.1(GND) R1.2 U1.3(VIN)
GND: B1.2 C1.2 C2.2 C3.2 D1.2(C) D2.2(C) P1.2(RIGHT) S2.1 S2.2 U1.1(GND)
VCC_IO: S1.1 S1.2
nRESET: S2.3 S2.4 ; off-sheet nRESET
nUSB_PWR: P1.3(LEFT) ; off-sheet nUSB_PWR
SYS_BOOT5: S1.3 S1.4 ; off-sheet SYS_BOOT5
VBACKUP: B1.1 ; off-sheet VBACKUP
NetD1_1: D1.1(A) R1.1
NetD2_1: D2.1(A) R2.1

### Notes on the sheet
- 5VDC +/- 10%
  Current 2.4-3 A
- (near S1) Hold S1 down while pressing and releasing S2. This
  will force a peripheral boot. S2 can also be used as a
  switch for applications or SW use after booting.
- (near R2) 0.8A Max output
- (near S2) Pressing and releasing S2 will reset ARM Processor

### Library data of the parts
B1 = ML-1220/V1AN: BATTERY LITHIUM 3V RECHARGE PC PINS; Manufacturer: Panasonic; Man P/N: ML-1220/V1AN
C1-C3 = CAP B: Tantalum capacitor. Case B
D1 D2 = LED0805: LED 0805; Value: *
P1 = PJ-002A: DC POWER JACK; Manufacturer: CIU Inc; Vendor: Digi-key; Alternative P/N: DJK-02A; Man P/N: PJ-002A
R1 R2 = R0603: Resistor 0603
S1 S2 = SWT-32: Push button; Vendor: brownbear.ru; Man P/N: SWT-32
U1 = LM1117: 800mA Low-Dropout Linear Regulator; Manufacturer: National; Man P/N: LM1117IMPX-3.3; Package: 3-lead  SOT-223

## Sheet sd_mmc.SchDoc
size A4
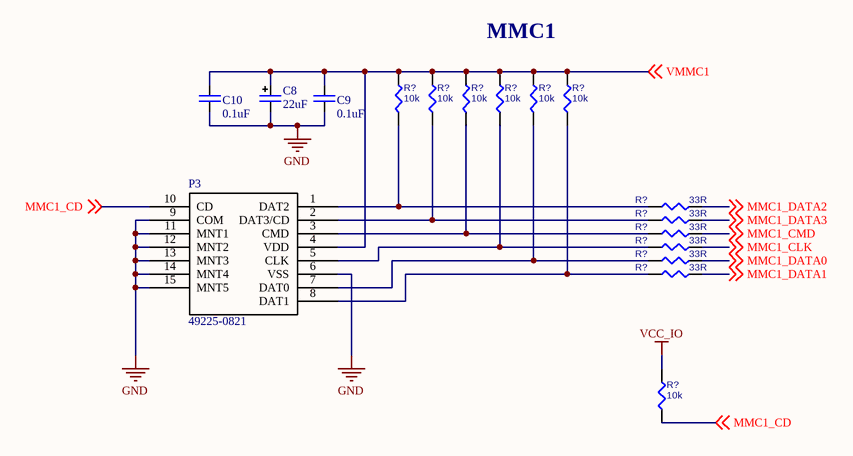
[diagram p5: sd_mmc.SchDoc]

### Parts
(Parts that share a designator on the sheet are numbered #1, #2 ... from top to bottom, then left to right.)
C8  value 22uF  [B]  (hidden comment: CAP B)
C9  value 0.1uF  [CHIP0603]  (hidden comment: C0603)
C10  value 0.1uF  [CHIP0603]  (hidden comment: C0603)
P3  49225-0821  [SDCard]
R?#2  value 10k  [CHIP0603]  (hidden comment: R0603)
R?#3  value 10k  [CHIP0603]  (hidden comment: R0603)
R?#4  value 10k  [CHIP0603]  (hidden comment: R0603)
R?#5  value 10k  [CHIP0603]  (hidden comment: R0603)
R?#6  value 10k  [CHIP0603]  (hidden comment: R0603)
R?#7  value 10k  [CHIP0603]  (hidden comment: R0603)
R?#8  value 33R  [CHIP0603]  (hidden comment: R0603)
R?#9  value 33R  [CHIP0603]  (hidden comment: R0603)
R?#10  value 33R  [CHIP0603]  (hidden comment: R0603)
R?#11  value 33R  [CHIP0603]  (hidden comment: R0603)
R?#12  value 33R  [CHIP0603]  (hidden comment: R0603)
R?#13  value 33R  [CHIP0603]  (hidden comment: R0603)
R?#14  value 10k  [CHIP0603]  (hidden comment: R0603)

### Nets
GND: C8.2 C9.2 C10.2 P3.6(VSS) P3.9(COM) P3.11(MNT1) P3.12(MNT2) P3.13(MNT3) P3.14(MNT4) P3.15(MNT5)
VCC_IO: R?#14.2
MMC1_CD: P3.10(CD) R?#14.1 ; off-sheet MMC1_CD
MMC1_CLK: R?#11.2 ; off-sheet MMC1_CLK
MMC1_CMD: R?#10.2 ; off-sheet MMC1_CMD
MMC1_DATA0: R?#12.2 ; off-sheet MMC1_DATA0
MMC1_DATA1: R?#13.2 ; off-sheet MMC1_DATA1
MMC1_DATA2: R?#8.2 ; off-sheet MMC1_DATA2
MMC1_DATA3: R?#9.2 ; off-sheet MMC1_DATA3
VMMC1: C8.1 C9.1 C10.1 P3.4(VDD) R?#2.2 R?#3.2 R?#4.2 R?#5.2 R?#6.2 R?#7.2 ; off-sheet VMMC1
NetP3_1: P3.1(DAT2) R?#2.1 R?#8.1
NetP3_2: P3.2(DAT3/CD) R?#3.1 R?#9.1
NetP3_3: P3.3(CMD) R?#4.1 R?#10.1
NetP3_5: P3.5(CLK) R?#5.1 R?#11.1
NetP3_7: P3.7(DAT0) R?#6.1 R?#12.1
NetP3_8: P3.8(DAT1) R?#7.1 R?#13.1

### Notes on the sheet
- (near R?#5) MMC1

### Library data of the parts
C8 = CAP B: Tantalum capacitor. Case B
C9 C10 = C0603: Ceramic capacitor C0603
P3 = Mol_49225-0821: Connector for microSD™ Card (Push-push Type); Manufacturer: Molex; Man P/N: 49225-0821
R?#2-R?#14 = R0603: Resistor 0603

## Sheet serial.SchDoc
size A4
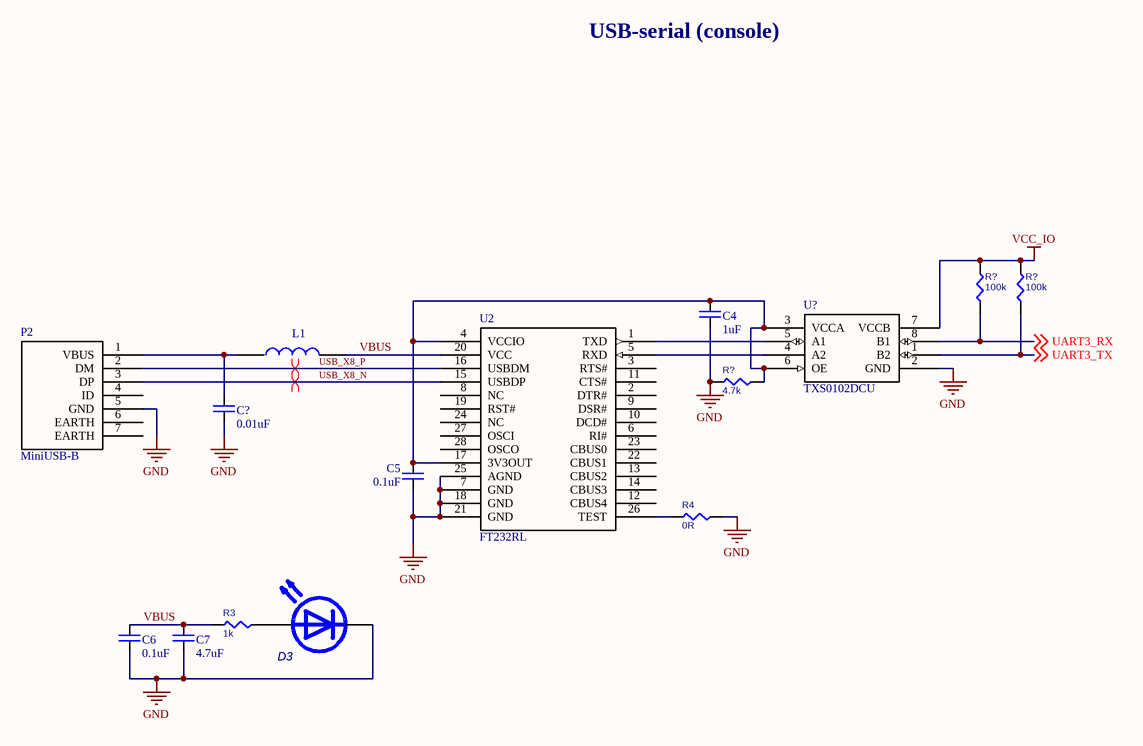
[diagram p6: serial.SchDoc]

### Parts
(Parts that share a designator on the sheet are numbered #1, #2 ... from top to bottom, then left to right.)
C4  value 1uF  [CHIP0603]  (hidden comment: C0603)
C5  value 0.1uF  [CHIP0603]  (hidden comment: C0603)
C6  value 0.1uF  [CHIP0603]  (hidden comment: C0603)
C7#2  value 4.7uF  [CHIP0603]  (hidden comment: C0603)
C?  value 0.01uF  [CHIP0603]  (hidden comment: C0603)
D3  LED0805  [LED0805]  (value not drawn)
L1  BLM18A-FB  [CHIP0603]  (value not drawn)
P2  MiniUSB-B  [MINI-USB-B5 SMT]
R3  value 1k  [CHIP0603]  (hidden comment: R0603)
R4  value 0R  [CHIP0603]  (hidden comment: R0603)
R?#15  value 100k  [CHIP0603]  (hidden comment: R0603)
R?#16  value 100k  [CHIP0603]  (hidden comment: R0603)
R?#17  value 4.7k  [CHIP0603]  (hidden comment: R0603)
U2  FT232RL  [SOP65P780X200-28N]
U?#3  TXS0102DCU  [PDSO8_DCU]

### Nets
GND: C4.1 C5.1 C6.1 C7#2.1 C?.2 D3.2(C) P2.5(GND) R4.1 R?#17.1 U2.7(GND) U2.18(GND) U2.21(GND) U2.25(AGND) U?#3.2(GND)
VCC_IO: R?#15.2 R?#16.2 U?#3.7(VCCB)
UART3_RX: R?#15.1 U?#3.8(B1) ; off-sheet UART3_RX
UART3_TX: R?#16.1 U?#3.1(B2) ; off-sheet UART3_TX
USB_X8_N: P2.3(DP) U2.15(USBDP)
USB_X8_P: P2.2(DM) U2.16(USBDM)
VBUS: C6.2 C7#2.2 L1.2 R3.2 U2.20(VCC)
NetC4_2: C4.2 C5.2 R?#17.2 U2.4(VCCIO) U2.17(3V3OUT) U?#3.3(VCCA) U?#3.6(OE)
NetC?_1: C?.1 L1.1 P2.1(VBUS)
NetD3_1: D3.1(A) R3.1
NetR4_2: R4.2 U2.26(TEST)
NetU2_1: U2.1(TXD) U?#3.5(A1)
NetU2_5: U2.5(RXD) U?#3.4(A2)

Not connected (* = marked no-connect by the designer): P2 4(ID) 6(EARTH) 7(EARTH); U2 2(DTR#) 3(RTS#) 6(RI#) 8(NC) 9(DSR#) 10(DCD#) 11(CTS#) 12(CBUS4) 13(CBUS2) 14(CBUS3) 19(RST#) 22(CBUS1) 23(CBUS0) 24(NC) 27(OSCI) 28(OSCO)

### Layout directives
differential pair: USB_X8_N, USB_X8_P

### Notes on the sheet
- USB-serial (console)

### Library data of the parts
C4-C6 C7#2 C? = C0603: Ceramic capacitor C0603
D3 = LED0805: LED 0805; Value: *
L1 = BLM18A-FB: Chip EMIFILr Inductor Type; Manufacturer: Murata; Man P/N: BLM18AG601SN1D
P2 = MiniUSB-B: Mini USB Type B CONNECTOR
R3 R4 R?#15-R?#17 = R0603: Resistor 0603
U2 = FT232RL: Single chip USB to USART transfer interface.; Manufacturer: FTDI; Man P/N: FT232RL; Package: 28 Pin SSOP
U?#3 = TXS0102DCU: as U8 on sheet hdmi; Package: DCU; Man P/N: TXS0102DCU

## Sheet som_connectors.SchDoc
size A3; PageSetup: Record=PageOptions|CenterHorizontal=True|CenterVertical=True|PrintScale=0.73|XCorrection=1.00|YCorrection=1.00|PrintKind=1|BorderSize=5000000|LeftOffset=0|BottomOffset=0|Orientation=2|PaperLength=1000|PaperWidth=1000|Scale=100|PaperSource=7|PrintQuality=-4|MediaType=1|DitherType=10|PaperKind=A4 (210 x 297 ìì)|PrintScaleMode=1
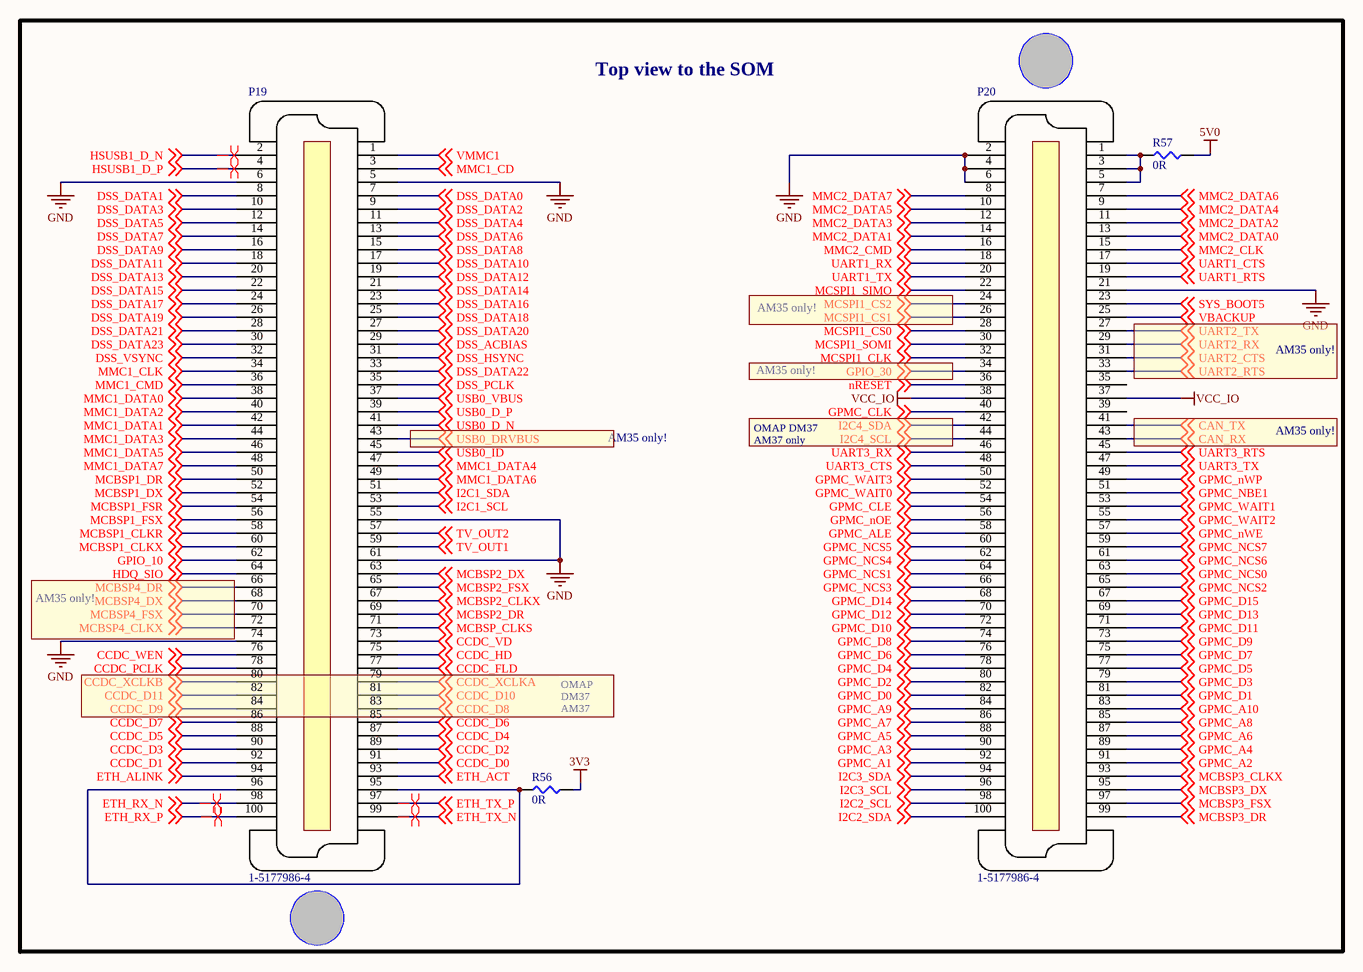
[diagram p7: som_connectors.SchDoc]

### Parts
P19  1-5177986-4  [1-5177986-4]
P20  1-5177986-4  [1-5177986-4]
R56  value 0R  [CHIP0805]  (hidden comment: R0805)
R57  value 0R  [CHIP0805]  (hidden comment: R0805)

### Nets
3V3: R56.2
5V0: R57.2
GND: P19.5 P19.6 P19.55 P19.61 P19.74 P20.2 P20.4 P20.6 P20.21
VCC_IO: P20.37 P20.38
CAN_RX: P20.43 ; off-sheet CAN_RX
CAN_TX: P20.41 ; off-sheet CAN_TX
CCDC_D0: P19.91 ; off-sheet CCDC_D0
CCDC_D1: P19.92 ; off-sheet CCDC_D1
CCDC_D2: P19.89 ; off-sheet CCDC_D2
CCDC_D3: P19.90 ; off-sheet CCDC_D3
CCDC_D4: P19.87 ; off-sheet CCDC_D4
CCDC_D5: P19.88 ; off-sheet CCDC_D5
CCDC_D6: P19.85 ; off-sheet CCDC_D6
CCDC_D7: P19.86 ; off-sheet CCDC_D7
CCDC_D8: P19.83 ; off-sheet CCDC_D8
CCDC_D9: P19.84 ; off-sheet CCDC_D9
CCDC_D10: P19.81 ; off-sheet CCDC_D10
CCDC_D11: P19.82 ; off-sheet CCDC_D11
CCDC_FLD: P19.77 ; off-sheet CCDC_FLD
CCDC_HD: P19.75 ; off-sheet CCDC_HD
CCDC_PCLK: P19.78 ; off-sheet CCDC_PCLK
CCDC_VD: P19.73 ; off-sheet CCDC_VD
CCDC_WEN: P19.76 ; off-sheet CCDC_WEN
CCDC_XCLKA: P19.79 ; off-sheet CCDC_XCLKA
CCDC_XCLKB: P19.80 ; off-sheet CCDC_XCLKB
DSS_ACBIAS: P19.29 ; off-sheet DSS_ACBIAS
DSS_DATA0: P19.7 ; off-sheet DSS_DATA0
DSS_DATA1: P19.8 ; off-sheet DSS_DATA1
DSS_DATA2: P19.9 ; off-sheet DSS_DATA2
DSS_DATA3: P19.10 ; off-sheet DSS_DATA3
DSS_DATA4: P19.11 ; off-sheet DSS_DATA4
DSS_DATA5: P19.12 ; off-sheet DSS_DATA5
DSS_DATA6: P19.13 ; off-sheet DSS_DATA6
DSS_DATA7: P19.14 ; off-sheet DSS_DATA7
DSS_DATA8: P19.15 ; off-sheet DSS_DATA8
DSS_DATA9: P19.16 ; off-sheet DSS_DATA9
DSS_DATA10: P19.17 ; off-sheet DSS_DATA10
DSS_DATA11: P19.18 ; off-sheet DSS_DATA11
DSS_DATA12: P19.19 ; off-sheet DSS_DATA12
DSS_DATA13: P19.20 ; off-sheet DSS_DATA13
DSS_DATA14: P19.21 ; off-sheet DSS_DATA14
DSS_DATA15: P19.22 ; off-sheet DSS_DATA15
DSS_DATA16: P19.23 ; off-sheet DSS_DATA16
DSS_DATA17: P19.24 ; off-sheet DSS_DATA17
DSS_DATA18: P19.25 ; off-sheet DSS_DATA18
DSS_DATA19: P19.26 ; off-sheet DSS_DATA19
DSS_DATA20: P19.27 ; off-sheet DSS_DATA20
DSS_DATA21: P19.28 ; off-sheet DSS_DATA21
DSS_DATA22: P19.33 ; off-sheet DSS_DATA22
DSS_DATA23: P19.30 ; off-sheet DSS_DATA23
DSS_HSYNC: P19.31 ; off-sheet DSS_HSYNC
DSS_PCLK: P19.35 ; off-sheet DSS_PCLK
DSS_VSYNC: P19.32 ; off-sheet DSS_VSYNC
ETH_ACT: P19.93 ; off-sheet ETH_ACT
ETH_ALINK: P19.94 ; off-sheet ETH_ALINK
ETH_RX_N: P19.98 ; off-sheet ETH_RX_N
ETH_RX_P: P19.100 ; off-sheet ETH_RX_P
ETH_TX_N: P19.99 ; off-sheet ETH_TX_N
ETH_TX_P: P19.97 ; off-sheet ETH_TX_P
GPIO_10: P19.62 ; off-sheet GPIO_10
GPIO_30: P20.34 ; off-sheet GPIO_30
GPMC_A1: P20.92 ; off-sheet GPMC_A1
GPMC_A2: P20.91 ; off-sheet GPMC_A2
GPMC_A3: P20.90 ; off-sheet GPMC_A3
GPMC_A4: P20.89 ; off-sheet GPMC_A4
GPMC_A5: P20.88 ; off-sheet GPMC_A5
GPMC_A6: P20.87 ; off-sheet GPMC_A6
GPMC_A7: P20.86 ; off-sheet GPMC_A7
GPMC_A8: P20.85 ; off-sheet GPMC_A8
GPMC_A9: P20.84 ; off-sheet GPMC_A9
GPMC_A10: P20.83 ; off-sheet GPMC_A10
GPMC_ALE: P20.58 ; off-sheet GPMC_ALE
GPMC_CLE: P20.54 ; off-sheet GPMC_CLE
GPMC_CLK: P20.40 ; off-sheet GPMC_CLK
GPMC_D0: P20.82 ; off-sheet GPMC_D0
GPMC_D1: P20.81 ; off-sheet GPMC_D1
GPMC_D2: P20.80 ; off-sheet GPMC_D2
GPMC_D3: P20.79 ; off-sheet GPMC_D3
GPMC_D4: P20.78 ; off-sheet GPMC_D4
GPMC_D5: P20.77 ; off-sheet GPMC_D5
GPMC_D6: P20.76 ; off-sheet GPMC_D6
GPMC_D7: P20.75 ; off-sheet GPMC_D7
GPMC_D8: P20.74 ; off-sheet GPMC_D8
GPMC_D9: P20.73 ; off-sheet GPMC_D9
GPMC_D10: P20.72 ; off-sheet GPMC_D10
GPMC_D11: P20.71 ; off-sheet GPMC_D11
GPMC_D12: P20.70 ; off-sheet GPMC_D12
GPMC_D13: P20.69 ; off-sheet GPMC_D13
GPMC_D14: P20.68 ; off-sheet GPMC_D14
GPMC_D15: P20.67 ; off-sheet GPMC_D15
GPMC_NBE1: P20.51 ; off-sheet GPMC_NBE1
GPMC_NCS0: P20.63 ; off-sheet GPMC_NCS0
GPMC_NCS1: P20.64 ; off-sheet GPMC_NCS1
GPMC_NCS2: P20.65 ; off-sheet GPMC_NCS2
GPMC_NCS3: P20.66 ; off-sheet GPMC_NCS3
GPMC_NCS4: P20.62 ; off-sheet GPMC_NCS4
GPMC_NCS5: P20.60 ; off-sheet GPMC_NCS5
GPMC_NCS6: P20.61 ; off-sheet GPMC_NCS6
GPMC_NCS7: P20.59 ; off-sheet GPMC_NCS7
GPMC_nOE: P20.56 ; off-sheet GPMC_nOE
GPMC_nWE: P20.57 ; off-sheet GPMC_nWE
GPMC_nWP: P20.49 ; off-sheet GPMC_nWP
GPMC_WAIT0: P20.52 ; off-sheet GPMC_WAIT0
GPMC_WAIT1: P20.53 ; off-sheet GPMC_WAIT1
GPMC_WAIT2: P20.55 ; off-sheet GPMC_WAIT2
GPMC_WAIT3: P20.50 ; off-sheet GPMC_WAIT3
HDQ_SIO: P19.64 ; off-sheet HDQ_SIO
HSUSB1_D_N: P19.2 ; off-sheet HSUSB1_D_N
HSUSB1_D_P: P19.4 ; off-sheet HSUSB1_D_P
I2C1_SCL: P19.53 ; off-sheet I2C1_SCL
I2C1_SDA: P19.51 ; off-sheet I2C1_SDA
I2C2_SCL: P20.98 ; off-sheet I2C2_SCL
I2C2_SDA: P20.100 ; off-sheet I2C2_SDA
I2C3_SCL: P20.96 ; off-sheet I2C3_SCL
I2C3_SDA: P20.94 ; off-sheet I2C3_SDA
I2C4_SCL: P20.44 ; off-sheet I2C4_SCL
I2C4_SDA: P20.42 ; off-sheet I2C4_SDA
McBSP1_CLKR: P19.58 ; off-sheet MCBSP1_CLKR
McBSP1_CLKX: P19.60 ; off-sheet MCBSP1_CLKX
McBSP1_DR: P19.50 ; off-sheet MCBSP1_DR
McBSP1_DX: P19.52 ; off-sheet MCBSP1_DX
McBSP1_FSR: P19.54 ; off-sheet MCBSP1_FSR
McBSP1_FSX: P19.56 ; off-sheet MCBSP1_FSX
MCBSP2_CLKX: P19.67 ; off-sheet MCBSP2_CLKX
MCBSP2_DR: P19.69 ; off-sheet MCBSP2_DR
MCBSP2_DX: P19.63 ; off-sheet MCBSP2_DX
MCBSP2_FSX: P19.65 ; off-sheet MCBSP2_FSX
MCBSP3_CLKX: P20.93 ; off-sheet MCBSP3_CLKX
MCBSP3_DR: P20.99 ; off-sheet MCBSP3_DR
MCBSP3_DX: P20.95 ; off-sheet MCBSP3_DX
MCBSP3_FSX: P20.97 ; off-sheet MCBSP3_FSX
MCBSP4_CLKX: P19.72 ; off-sheet MCBSP4_CLKX
MCBSP4_DR: P19.66 ; off-sheet MCBSP4_DR
MCBSP4_DX: P19.68 ; off-sheet MCBSP4_DX
MCBSP4_FSX: P19.70 ; off-sheet MCBSP4_FSX
MCBSP_CLKS: P19.71 ; off-sheet MCBSP_CLKS
MCSPI1_CLK: P20.32 ; off-sheet MCSPI1_CLK
MCSPI1_CS0: P20.28 ; off-sheet MCSPI1_CS0
MCSPI1_CS1: P20.26 ; off-sheet MCSPI1_CS1
MCSPI1_CS2: P20.24 ; off-sheet MCSPI1_CS2
MCSPI1_SIMO: P20.22 ; off-sheet MCSPI1_SIMO
MCSPI1_SOMI: P20.30 ; off-sheet MCSPI1_SOMI
MMC1_CD: P19.3 ; off-sheet MMC1_CD
MMC1_CLK: P19.34 ; off-sheet MMC1_CLK
MMC1_CMD: P19.36 ; off-sheet MMC1_CMD
MMC1_DATA0: P19.38 ; off-sheet MMC1_DATA0
MMC1_DATA1: P19.42 ; off-sheet MMC1_DATA1
MMC1_DATA2: P19.40 ; off-sheet MMC1_DATA2
MMC1_DATA3: P19.44 ; off-sheet MMC1_DATA3
MMC1_DATA4: P19.47 ; off-sheet MMC1_DATA4
MMC1_DATA5: P19.46 ; off-sheet MMC1_DATA5
MMC1_DATA6: P19.49 ; off-sheet MMC1_DATA6
MMC1_DATA7: P19.48 ; off-sheet MMC1_DATA7
MMC2_CLK: P20.15 ; off-sheet MMC2_CLK
MMC2_CMD: P20.16 ; off-sheet MMC2_CMD
MMC2_DATA0: P20.13 ; off-sheet MMC2_DATA0
MMC2_DATA1: P20.14 ; off-sheet MMC2_DATA1
MMC2_DATA2: P20.11 ; off-sheet MMC2_DATA2
MMC2_DATA3: P20.12 ; off-sheet MMC2_DATA3
MMC2_DATA4: P20.9 ; off-sheet MMC2_DATA4
MMC2_DATA5: P20.10 ; off-sheet MMC2_DATA5
MMC2_DATA6: P20.7 ; off-sheet MMC2_DATA6
MMC2_DATA7: P20.8 ; off-sheet MMC2_DATA7
nRESET: P20.36 ; off-sheet nRESET
SYS_BOOT5: P20.23 ; off-sheet SYS_BOOT5
TV_OUT1: P19.59 ; off-sheet TV_OUT1
TV_OUT2: P19.57 ; off-sheet TV_OUT2
UART1_CTS: P20.17 ; off-sheet UART1_CTS
UART1_RTS: P20.19 ; off-sheet UART1_RTS
UART1_RX: P20.18 ; off-sheet UART1_RX
UART1_TX: P20.20 ; off-sheet UART1_TX
UART2_CTS: P20.31 ; off-sheet UART2_CTS
UART2_RTS: P20.33 ; off-sheet UART2_RTS
UART2_RX: P20.29 ; off-sheet UART2_RX
UART2_TX: P20.27 ; off-sheet UART2_TX
UART3_CTS: P20.48 ; off-sheet UART3_CTS
UART3_RTS: P20.45 ; off-sheet UART3_RTS
UART3_RX: P20.46 ; off-sheet UART3_RX
UART3_TX: P20.47 ; off-sheet UART3_TX
USB0_D_N: P19.41 ; off-sheet USB0_D_N
USB0_D_P: P19.39 ; off-sheet USB0_D_P
USB0_DRVBUS: P19.43 ; off-sheet USB0_DRVBUS
USB0_ID: P19.45 ; off-sheet USB0_ID
USB0_VBUS: P19.37 ; off-sheet USB0_VBUS
VBACKUP: P20.25 ; off-sheet VBACKUP
VMMC1: P19.1 ; off-sheet VMMC1
NetP19_95: P19.95 P19.96 R56.1
NetP20_1: P20.1 P20.3 P20.5 R57.1

Not connected (* = marked no-connect by the designer): P20 35 39

### Layout directives
differential pair: ETH_RX_N, ETH_RX_P, ETH_TX_N, ETH_TX_P, HSUSB1_D_N, HSUSB1_D_P

### Notes on the sheet
- Top view to the SOM
- AM35 only!
- OMAP DM37
  AM37 only
- OMAP
  DM37
  AM37

### Library data of the parts
P19 P20 = 1-5177986-4: Fine Pitch SMT Stacking Connectors; Manufacturer: TE Connectivity; Man P/N: 1-5177986-4
R56 R57 = R0805: Film resistor

## Sheet usb.SchDoc
size A4
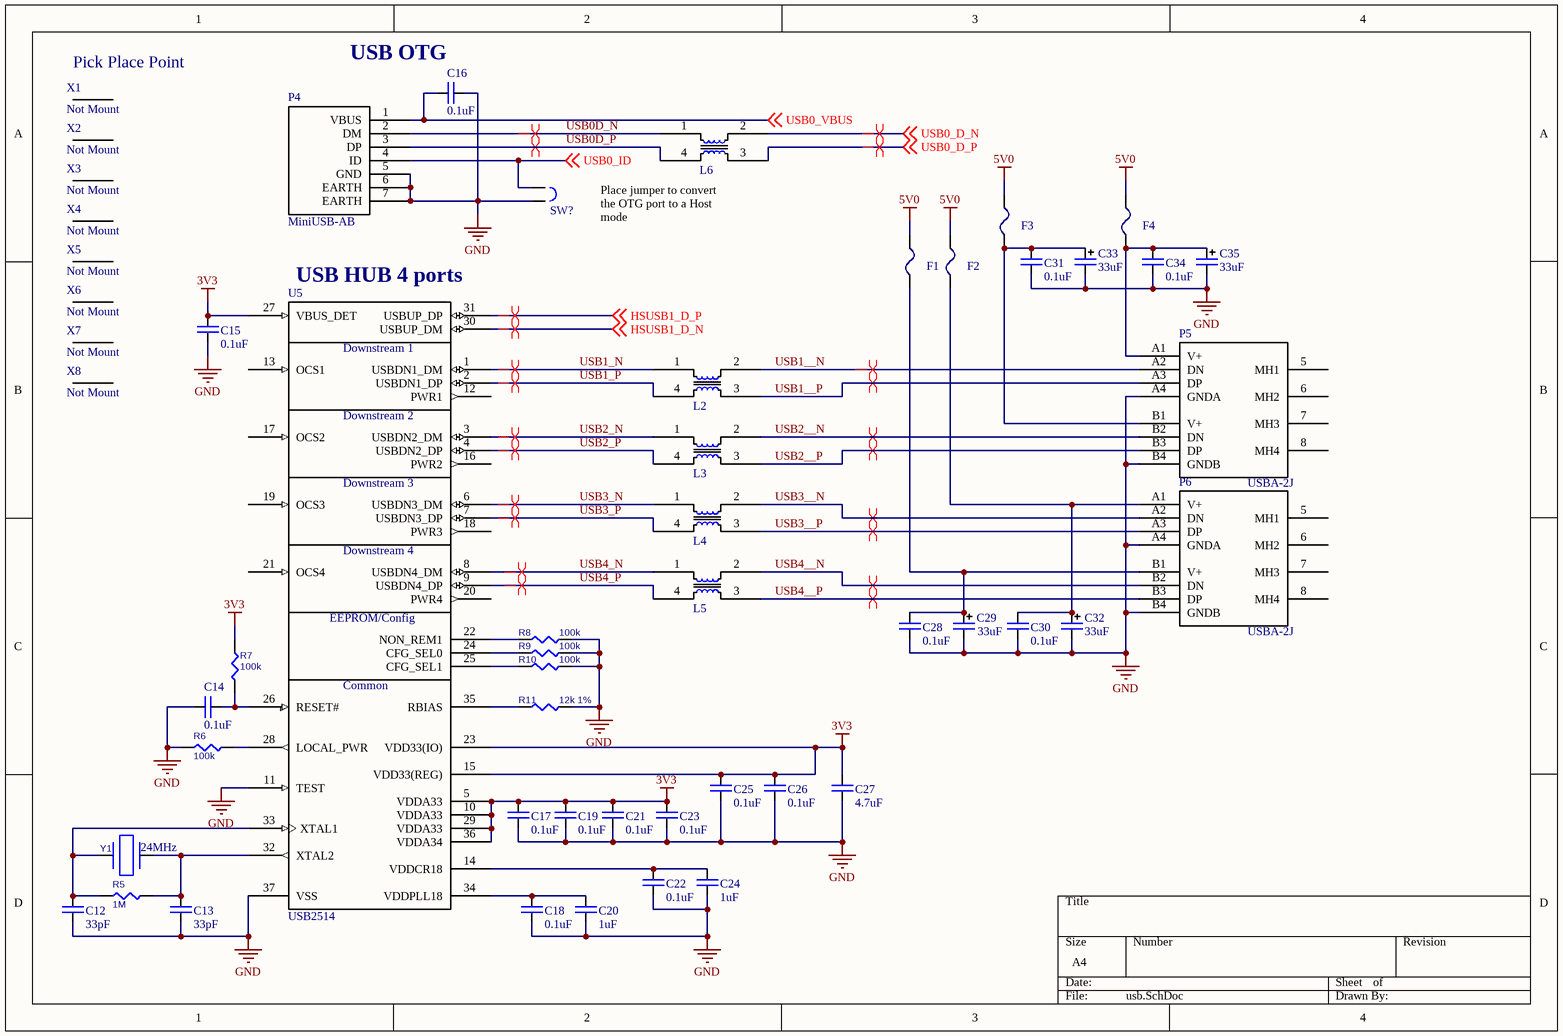
[diagram p8: usb.SchDoc]

### Parts
(Parts that share a designator on the sheet are numbered #1, #2 ... from top to bottom, then left to right.)
C12  value 33pF  [CHIP0603]  (hidden comment: C0603)
C13  value 33pF  [CHIP0603]  (hidden comment: C0603)
C14  value 0.1uF  [CHIP0603]  (hidden comment: C0603)
C15  value 0.1uF  [CHIP0603]  (hidden comment: C0603)
C16  value 0.1uF  [CHIP0603]  (hidden comment: C0603)
C17  value 0.1uF  [CHIP0603]  (hidden comment: C0603)
C18  value 0.1uF  [CHIP0603]  (hidden comment: C0603)
C19  value 0.1uF  [CHIP0603]  (hidden comment: C0603)
C20  value 1uF  [CHIP0603]  (hidden comment: C0603)
C21  value 0.1uF  [CHIP0603]  (hidden comment: C0603)
C22  value 0.1uF  [CHIP0603]  (hidden comment: C0603)
C23  value 0.1uF  [CHIP0603]  (hidden comment: C0603)
C24  value 1uF  [CHIP0603]  (hidden comment: C0603)
C25  value 0.1uF  [CHIP0603]  (hidden comment: C0603)
C26  value 0.1uF  [CHIP0603]  (hidden comment: C0603)
C27  value 4.7uF  [CHIP0603]  (hidden comment: C0603)
C28  value 0.1uF  [CHIP0603]  (hidden comment: C0603)
C29  value 33uF  [B]  (hidden comment: CAP B)
C30  value 0.1uF  [CHIP0603]  (hidden comment: C0603)
C31  value 0.1uF  [CHIP0603]  (hidden comment: C0603)
C32  value 33uF  [B]  (hidden comment: CAP B)
C33  value 33uF  [B]  (hidden comment: CAP B)
C34  value 0.1uF  [CHIP0603]  (hidden comment: C0603)
C35  value 33uF  [B]  (hidden comment: CAP B)
F1  MFU0603  [CHIP0603]  (value not drawn)
F2  MFU0603  [CHIP0603]  (value not drawn)
F3  MFU0603  [CHIP0603]  (value not drawn)
F4  MFU0603  [CHIP0603]  (value not drawn)
L2  DLW21H  [DLW21H]  (value not drawn)
L3  DLW21H  [DLW21H]  (value not drawn)
L4  DLW21H  [DLW21H]  (value not drawn)
L5  DLW21H  [DLW21H]  (value not drawn)
L6#2  DLW21H  [DLW21H]  (value not drawn)
P4  MiniUSB-AB  [MINI-USB-B5 SMT]
P5  USBA-2J  [USBA-2J]
P6  USBA-2J  [USBA-2J]
R5  value 1M  [CHIP0603]  (hidden comment: R0603)
R6  value 100k  [CHIP0603]  (hidden comment: R0603)
R7  value 100k  [CHIP0603]  (hidden comment: R0603)
R8  value 100k  [CHIP0603]  (hidden comment: R0603)
R9  value 100k  [CHIP0603]  (hidden comment: R0603)
R10  value 100k  [CHIP0603]  (hidden comment: R0603)
R11  value 12k 1%  [CHIP0603]  (hidden comment: R0603)
SW?#2  Jumper 2-pin  [JUMPER_2]  (value not drawn)
U5  USB2514  [QFN36]
X1  Not Mount  [POINT]
X2  Not Mount  [POINT]
X3  Not Mount  [POINT]
X4  Not Mount  [POINT]
X5  Not Mount  [POINT]
X6  Not Mount  [POINT]
X7  Not Mount  [POINT]
X8  Not Mount  [POINT]
Y1  value 24MHz  [HS49smd]  (hidden comment: Geyer KX-K 24.0)

### Nets
3V3: C15.2 C17.1 C19.1 C21.1 C23.1 C25.1 C26.1 C27.1 R7.2 U5.5(VDDA33) U5.10(VDDA33) U5.15(VDD33(REG)) U5.23(VDD33(IO)) U5.27(VBUS_DET) U5.29(VDDA33) U5.36(VDDA34)
5V0: F1.2 F2.2 F3.2 F4.2
GND: C12.2 C13.2 C14.1 C15.1 C16.2 C17.2 C18.2 C19.2 C20.2 C21.2 C22.2 C23.2 C24.2 C25.2 C26.2 C27.2 C28.2 C29.2 C30.2 C31.2 C32.2 C33.2 C34.2 C35.2 P4.5(GND) P4.6(EARTH) P4.7(EARTH) P5.A4(GNDA) P5.B4(GNDB) P6.A4(GNDA) P6.B4(GNDB) R6.2 R8.2 R9.2 R10.2 R11.2 SW?#2.2 U5.11(TEST) U5.37(VSS)
HSUSB1_D_N: U5.30(USBUP_DM) ; off-sheet HSUSB1_D_N
HSUSB1_D_P: U5.31(USBUP_DP) ; off-sheet HSUSB1_D_P
USB0_D_N: L6#2.2 ; off-sheet USB0_D_N
USB0_D_P: L6#2.3 ; off-sheet USB0_D_P
USB0_ID: P4.4(ID) SW?#2.1 ; off-sheet USB0_ID
USB0_VBUS: C16.1 P4.1(VBUS) ; off-sheet USB0_VBUS
USB0D_N: L6#2.1 P4.2(DM)
USB0D_P: L6#2.4 P4.3(DP)
USB1__N: L2.2 P5.A2(DN)
USB1__P: L2.3 P5.A3(DP)
USB1_N: L2.1 U5.1(USBDN1_DM)
USB1_P: L2.4 U5.2(USBDN1_DP)
USB2__N: L3.2 P5.B2(DN)
USB2__P: L3.3 P5.B3(DP)
USB2_N: L3.1 U5.3(USBDN2_DM)
USB2_P: L3.4 U5.4(USBDN2_DP)
USB3__N: L4.2 P6.A2(DN)
USB3__P: L4.3 P6.A3(DP)
USB3_N: L4.1 U5.6(USBDN3_DM)
USB3_P: L4.4 U5.7(USBDN3_DP)
USB4__N: L5.2 P6.B2(DN)
USB4__P: L5.3 P6.B3(DP)
USB4_N: L5.1 U5.8(USBDN4_DM)
USB4_P: L5.4 U5.9(USBDN4_DP)
NetC12_1: C12.1 R5.2 U5.33(XTAL1) Y1.1
NetC13_1: C13.1 R5.1 U5.32(XTAL2) Y1.2
NetC14_2: C14.2 R7.1 U5.26(RESET#)
NetC18_1: C18.1 C20.1 U5.34(VDDPLL18)
NetC22_1: C22.1 C24.1 U5.14(VDDCR18)
NetC28_1: C28.1 C29.1 F1.1 P6.B1(V+)
NetC30_1: C30.1 C32.1 F2.1 P6.A1(V+)
NetC31_1: C31.1 C33.1 F3.1 P5.B1(V+)
NetC34_1: C34.1 C35.1 F4.1 P5.A1(V+)
NetR6_1: R6.1 U5.28(LOCAL_PWR)
NetR8_1: R8.1 U5.22(NON_REM1)
NetR9_1: R9.1 U5.24(CFG_SEL0)
NetR10_1: R10.1 U5.25(CFG_SEL1)
NetR11_1: R11.1 U5.35(RBIAS)

Not connected (* = marked no-connect by the designer): P5 5(MH1) 6(MH2) 7(MH3) 8(MH4); P6 5(MH1) 6(MH2) 7(MH3) 8(MH4); U5 12(PWR1) 13(OCS1) 16(PWR2) 17(OCS2) 18(PWR3) 19(OCS3) 20(PWR4) 21(OCS4); X1 1; X2 1; X3 1; X4 1; X5 1; X6 1; X7 1; X8 1

### Layout directives
differential pair: HSUSB1_D_N, HSUSB1_D_P, USB0_D_N, USB0_D_P, USB0D_N, USB0D_P, USB1__N, USB1__P, USB1_N, USB1_P, USB2__N, USB2__P, USB2_N, USB2_P, USB3__N, USB3__P, USB3_N, USB3_P, USB4__N, USB4__P, USB4_N, USB4_P

### Notes on the sheet
- (near X1) Pick Place Point
- USB OTG
- (near L6#2) Place jumper to convert the OTG port to a Host mode
- (near U5) USB HUB 4 ports
- (in symbol USB2514) Downstream 1; Downstream 2; Downstream 3; Downstream 4; EEPROM/Config; Common

### Library data of the parts
C12-C28 C30 C31 C34 = C0603: Ceramic capacitor C0603
C29 C32 C33 C35 = CAP B: Tantalum capacitor. Case B
F1-F4 = MFU0603: Thin Film Fuse; Manufacturer: Vishay; Man P/N: MFU0603FF01500P100; Package: 0603
L2-L5 L6#2 = DLW21H: Low profile wire-wound common choke coil; Manufacturer: Murata; Man P/N: DLW21HN900SQ2
P4 = MiniUSB-AB: Mini USB Type AB CONNECTOR
P5 P6 = USBA-2J: USB HOST Type A Double CONNECTOR; Vendor: brownbear.ru; Man P/N: USBA-2J
R5-R11 = R0603: Resistor 0603
SW?#2 = Jumper 2-pin: Jumper 2-pin 2.54mm
U5 = USB2514: USB 2.0 High-Speed HUB controller; Manufacturer: SMSC; Man P/N: USB2514-AEZG; Package: 36QFN
X1-X8 = Point Pick: Pick Point
Y1 = KX-12B: Quartz crystal  SMD

## Nets that join several sheets
3V3: audio (9 pins), camera (C85.1 P18.24 P18.25 P18.26), ethernet (L?.1), hdmi (12 pins), power (C3.1 R2.2 U1.2 U1.4), som_connectors (R56.2), usb (16 pins)
5V0: ethernet (P9.2), hdmi (P11.1 P11.2 RT1.1), power (5 pins), som_connectors (R57.2), usb (F1.2 F2.2 F3.2 F4.2)
GND: audio (15 pins), camera (9 pins), ethernet (9 pins), hdmi (43 pins), power (10 pins), sd_mmc (10 pins), serial (14 pins), som_connectors (9 pins), usb (39 pins)
VCC_IO: audio (5 pins), camera (6 pins), ethernet (P9.1), hdmi (8 pins), power (S1.1 S1.2), sd_mmc (R?#14.2), serial (R?#15.2 R?#16.2 U?#3.7), som_connectors (P20.37 P20.38)
CAN_RX: ethernet (U?#1.4), som_connectors (P20.43)
CAN_TX: ethernet (U?#1.1), som_connectors (P20.41)
CCDC_D0: camera (P18.23), som_connectors (P19.91)
CCDC_D1: camera (P18.21), som_connectors (P19.92)
CCDC_D2: camera (P18.19), som_connectors (P19.89)
CCDC_D3: camera (P18.17), som_connectors (P19.90)
CCDC_D4: camera (P18.15), som_connectors (P19.87)
CCDC_D5: camera (P18.13), som_connectors (P19.88)
CCDC_D6: camera (P18.11), som_connectors (P19.85)
CCDC_D7: camera (P18.9), som_connectors (P19.86)
CCDC_D8: camera (P18.7), som_connectors (P19.83)
CCDC_D9: camera (P18.5), som_connectors (P19.84)
CCDC_D10: camera (P18.3), som_connectors (P19.81)
CCDC_D11: camera (P18.1), som_connectors (P19.82)
CCDC_FLD: camera (P18.10), som_connectors (P19.77)
CCDC_HD: camera (P18.29), som_connectors (P19.75)
CCDC_PCLK: camera (P18.27), som_connectors (P19.78)
CCDC_VD: camera (P18.31), som_connectors (P19.73)
CCDC_WEN: camera (P18.12 R55.1), som_connectors (P19.76)
CCDC_XCLKA: camera (P18.2), som_connectors (P19.79)
DSS_ACBIAS: hdmi (RR15.2), som_connectors (P19.29)
DSS_DATA0: hdmi (RR9.8), som_connectors (P19.7)
DSS_DATA1: hdmi (RR9.7), som_connectors (P19.8)
DSS_DATA2: hdmi (RR9.6), som_connectors (P19.9)
DSS_DATA3: hdmi (RR9.5), som_connectors (P19.10)
DSS_DATA4: hdmi (RR10.8), som_connectors (P19.11)
DSS_DATA5: hdmi (RR10.7), som_connectors (P19.12)
DSS_DATA6: hdmi (RR10.6), som_connectors (P19.13)
DSS_DATA7: hdmi (RR10.5), som_connectors (P19.14)
DSS_DATA8: hdmi (RR11.8), som_connectors (P19.15)
DSS_DATA9: hdmi (RR11.7), som_connectors (P19.16)
DSS_DATA10: hdmi (RR11.6), som_connectors (P19.17)
DSS_DATA11: hdmi (RR11.5), som_connectors (P19.18)
DSS_DATA12: hdmi (RR12.8), som_connectors (P19.19)
DSS_DATA13: hdmi (RR12.7), som_connectors (P19.20)
DSS_DATA14: hdmi (RR12.6), som_connectors (P19.21)
DSS_DATA15: hdmi (RR12.5), som_connectors (P19.22)
DSS_DATA16: hdmi (RR13.8), som_connectors (P19.23)
DSS_DATA17: hdmi (RR13.7), som_connectors (P19.24)
DSS_DATA18: hdmi (RR13.6), som_connectors (P19.25)
DSS_DATA19: hdmi (RR13.5), som_connectors (P19.26)
DSS_DATA20: hdmi (RR14.8), som_connectors (P19.27)
DSS_DATA21: hdmi (RR14.7), som_connectors (P19.28)
DSS_DATA22: hdmi (RR14.6), som_connectors (P19.33)
DSS_DATA23: hdmi (RR14.5), som_connectors (P19.30)
DSS_HSYNC: hdmi (RR15.3), som_connectors (P19.31)
DSS_PCLK: hdmi (RR15.1), som_connectors (P19.35)
DSS_VSYNC: hdmi (RR15.4), som_connectors (P19.32)
ETH_ACT: ethernet (P?#1.9), som_connectors (P19.93)
ETH_ALINK: ethernet (P?#1.12), som_connectors (P19.94)
ETH_RX_N: ethernet (P?#1.6), som_connectors (P19.98)
ETH_RX_P: ethernet (P?#1.3), som_connectors (P19.100)
ETH_TX_N: ethernet (P?#1.2), som_connectors (P19.99)
ETH_TX_P: ethernet (P?#1.1), som_connectors (P19.97)
GPIO_10: hdmi (U?#2.2), som_connectors (P19.62)
GPMC_NCS4: audio (U11.31), som_connectors (P20.62)
HSUSB1_D_N: som_connectors (P19.2), usb (U5.30)
HSUSB1_D_P: som_connectors (P19.4), usb (U5.31)
I2C2_SCL: audio (U11.8), camera (P18.8), ethernet (P9.24), som_connectors (P20.98)
I2C2_SDA: audio (U11.9), camera (P18.6), ethernet (P9.23), som_connectors (P20.100)
I2C3_SCL: hdmi (P12.14 U8.5), som_connectors (P20.96)
I2C3_SDA: hdmi (P11.15 U8.4), som_connectors (P20.94)
McBSP1_CLKR: ethernet (P9.20), som_connectors (P19.58)
McBSP1_CLKX: ethernet (P9.14), som_connectors (P19.60)
McBSP1_DR: ethernet (P9.18), som_connectors (P19.50)
McBSP1_DX: ethernet (P9.12), som_connectors (P19.52)
McBSP1_FSR: ethernet (P9.22), som_connectors (P19.54)
McBSP1_FSX: ethernet (P9.16), som_connectors (P19.56)
MCBSP2_CLKX: audio (RR16.1), som_connectors (P19.67)
MCBSP2_DR: audio (RR16.4), som_connectors (P19.69)
MCBSP2_DX: audio (RR16.3), som_connectors (P19.63)
MCBSP2_FSX: audio (RR16.2), som_connectors (P19.65)
MCBSP3_CLKX: ethernet (P9.6), som_connectors (P20.93)
MCBSP3_DR: ethernet (P9.10), som_connectors (P20.99)
MCBSP3_DX: ethernet (P9.4), som_connectors (P20.95)
MCBSP3_FSX: ethernet (P9.8), som_connectors (P20.97)
MCBSP_CLKS: audio (R45.1), som_connectors (P19.71)
MMC1_CD: sd_mmc (P3.10 R?#14.1), som_connectors (P19.3)
MMC1_CLK: sd_mmc (R?#11.2), som_connectors (P19.34)
MMC1_CMD: sd_mmc (R?#10.2), som_connectors (P19.36)
MMC1_DATA0: sd_mmc (R?#12.2), som_connectors (P19.38)
MMC1_DATA1: sd_mmc (R?#13.2), som_connectors (P19.42)
MMC1_DATA2: sd_mmc (R?#8.2), som_connectors (P19.40)
MMC1_DATA3: sd_mmc (R?#9.2), som_connectors (P19.44)
MMC2_CLK: ethernet (P9.21), som_connectors (P20.15)
MMC2_CMD: ethernet (P9.19), som_connectors (P20.16)
MMC2_DATA0: ethernet (P9.17), som_connectors (P20.13)
MMC2_DATA1: ethernet (P9.15), som_connectors (P20.14)
MMC2_DATA2: ethernet (P9.13), som_connectors (P20.11)
MMC2_DATA3: ethernet (P9.11), som_connectors (P20.12)
MMC2_DATA4: ethernet (P9.9), som_connectors (P20.9)
MMC2_DATA5: ethernet (P9.7), som_connectors (P20.10)
MMC2_DATA6: ethernet (P9.5), som_connectors (P20.7)
MMC2_DATA7: ethernet (P9.3), som_connectors (P20.8)
nRESET: ethernet (P9.26), power (S2.3 S2.4), som_connectors (P20.36)
nUSB_PWR: hdmi (P12.12), power (P1.3)
SYS_BOOT5: power (S1.3 S1.4), som_connectors (P20.23)
TV_OUT1: hdmi (P13.3), som_connectors (P19.59)
TV_OUT2: hdmi (P13.4), som_connectors (P19.57)
UART3_RX: serial (R?#15.1 U?#3.8), som_connectors (P20.46)
UART3_TX: serial (R?#16.1 U?#3.1), som_connectors (P20.47)
USB0_D_N: som_connectors (P19.41), usb (L6#2.2)
USB0_D_P: som_connectors (P19.39), usb (L6#2.3)
USB0_ID: som_connectors (P19.45), usb (P4.4 SW?#2.1)
USB0_VBUS: som_connectors (P19.37), usb (C16.1 P4.1)
VBACKUP: power (B1.1), som_connectors (P20.25)
VMMC1: sd_mmc (10 pins), som_connectors (P19.1)